# EAGLE design House LED board (EAGLE 9.5.0)
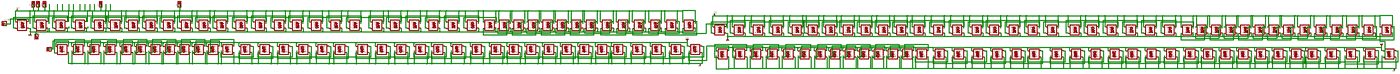
[diagram p0: schematic, sheet 1, overview]
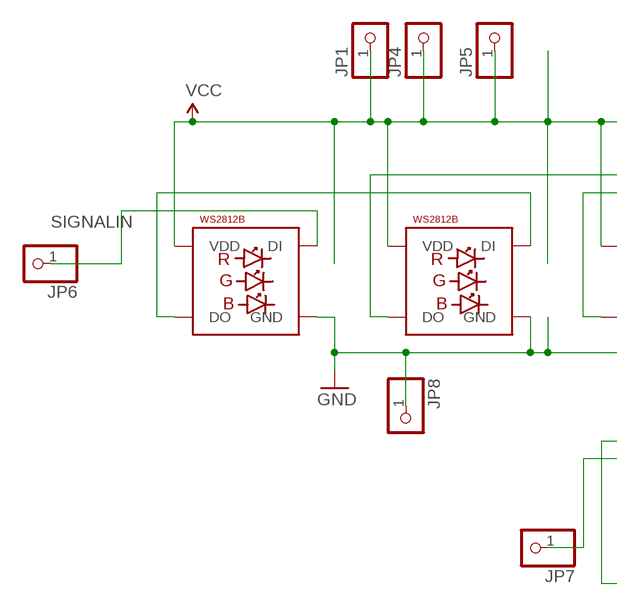
[diagram p1: schematic, sheet 1, part 1 of 8]
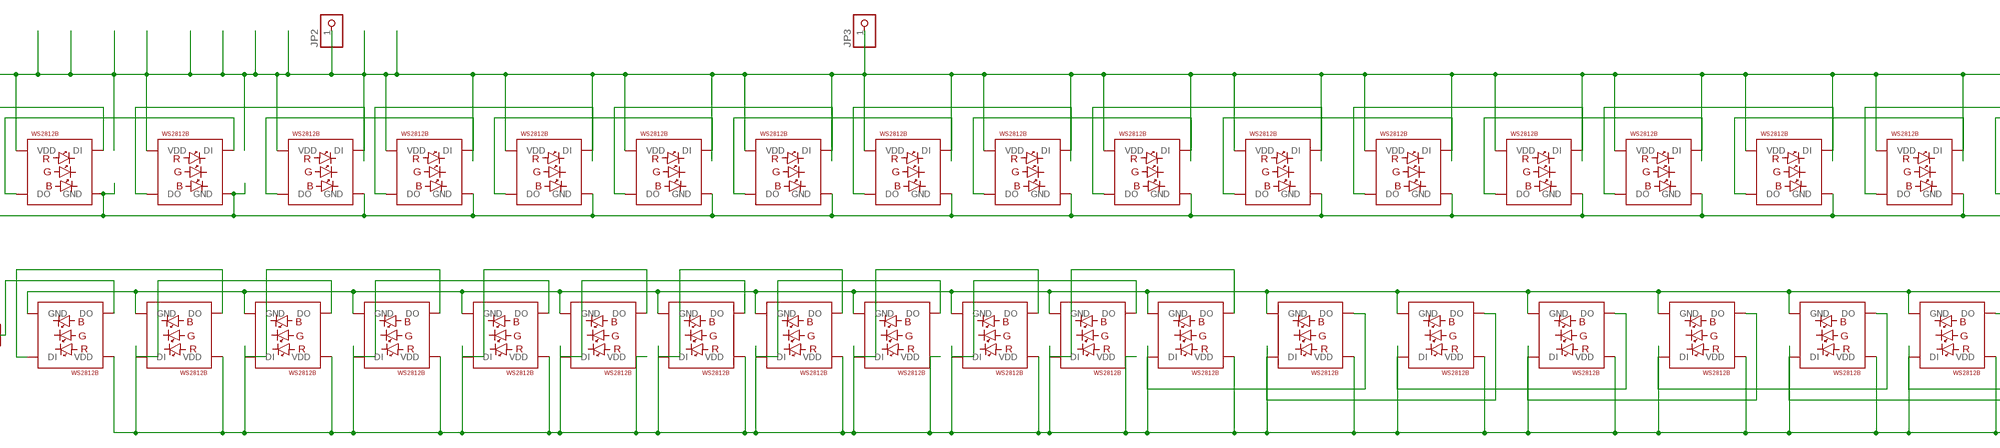
[diagram p2: schematic, sheet 1, part 2 of 8]
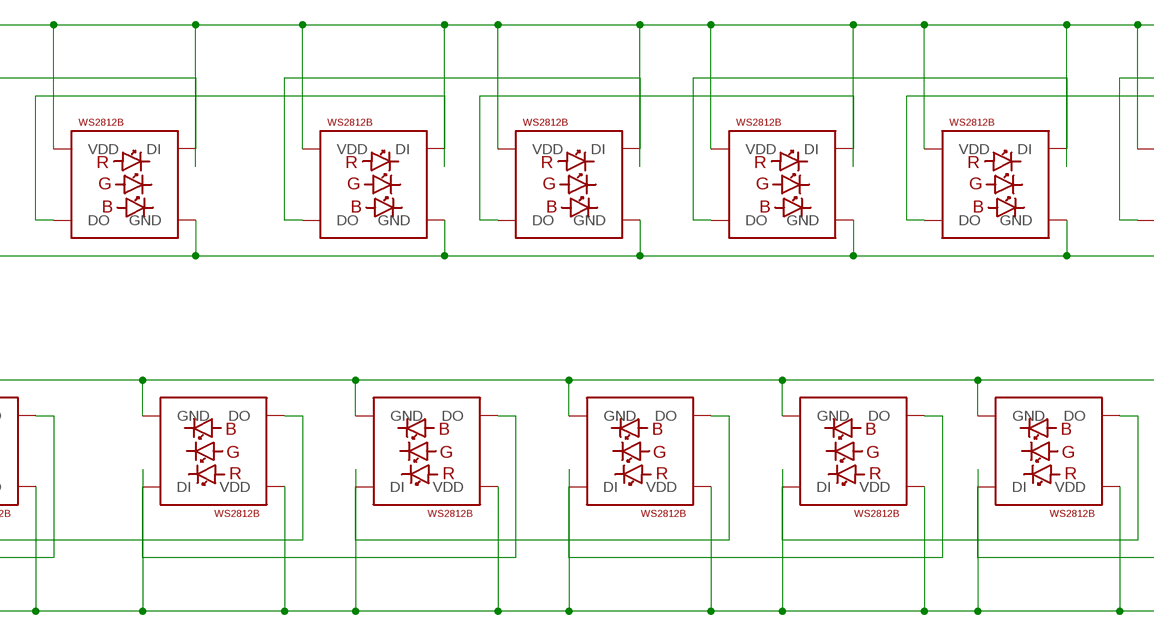
[diagram p3: schematic, sheet 1, part 3 of 8]
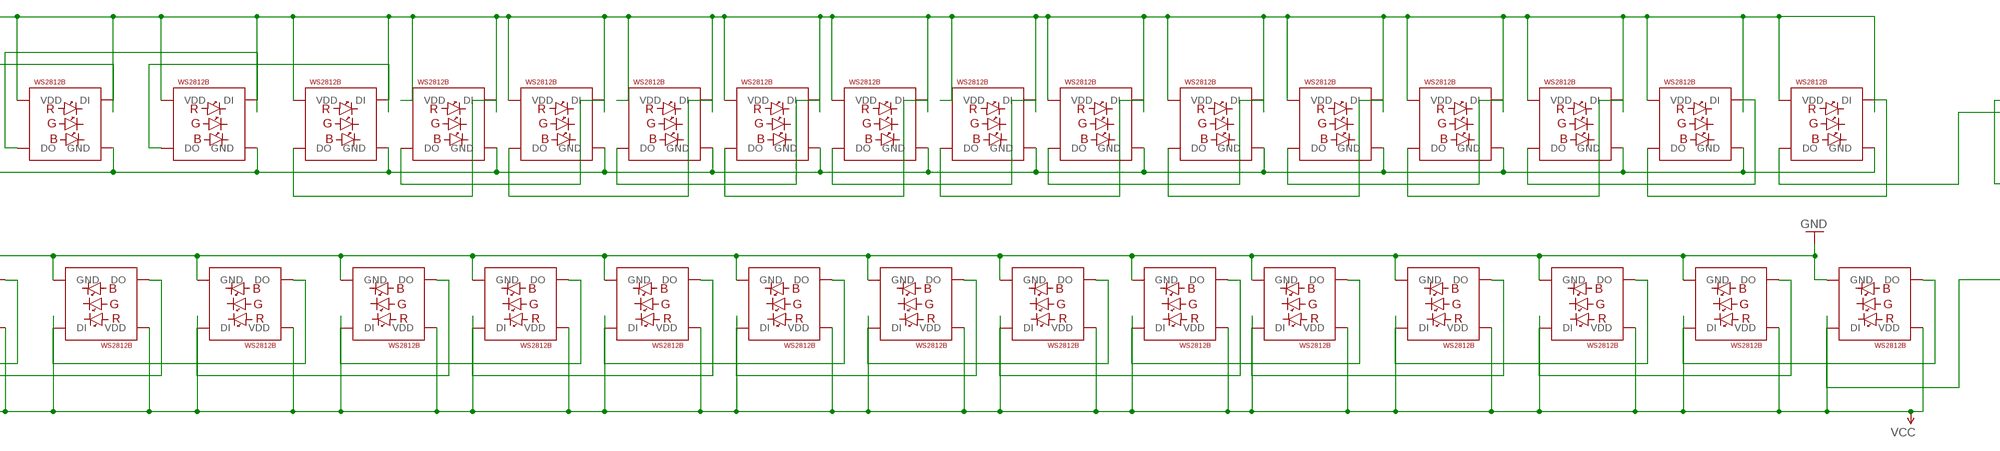
[diagram p4: schematic, sheet 1, part 4 of 8]
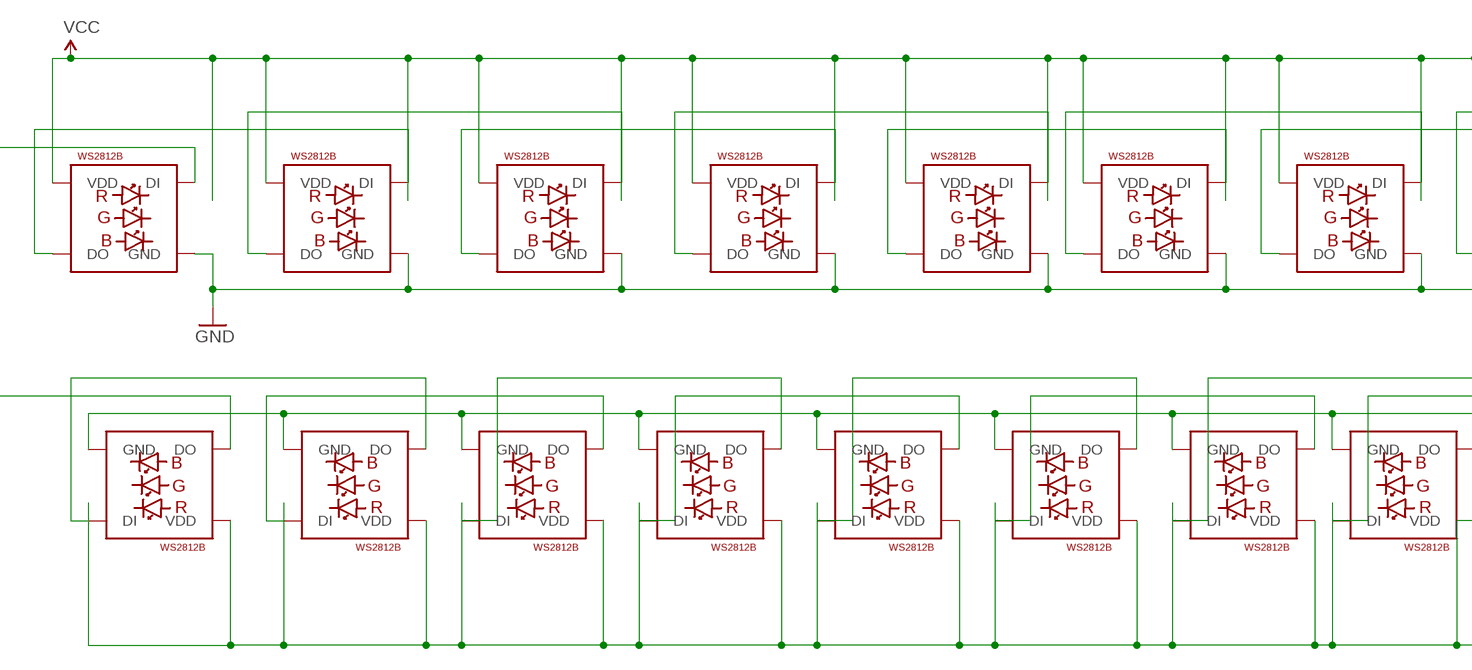
[diagram p5: schematic, sheet 1, part 5 of 8]
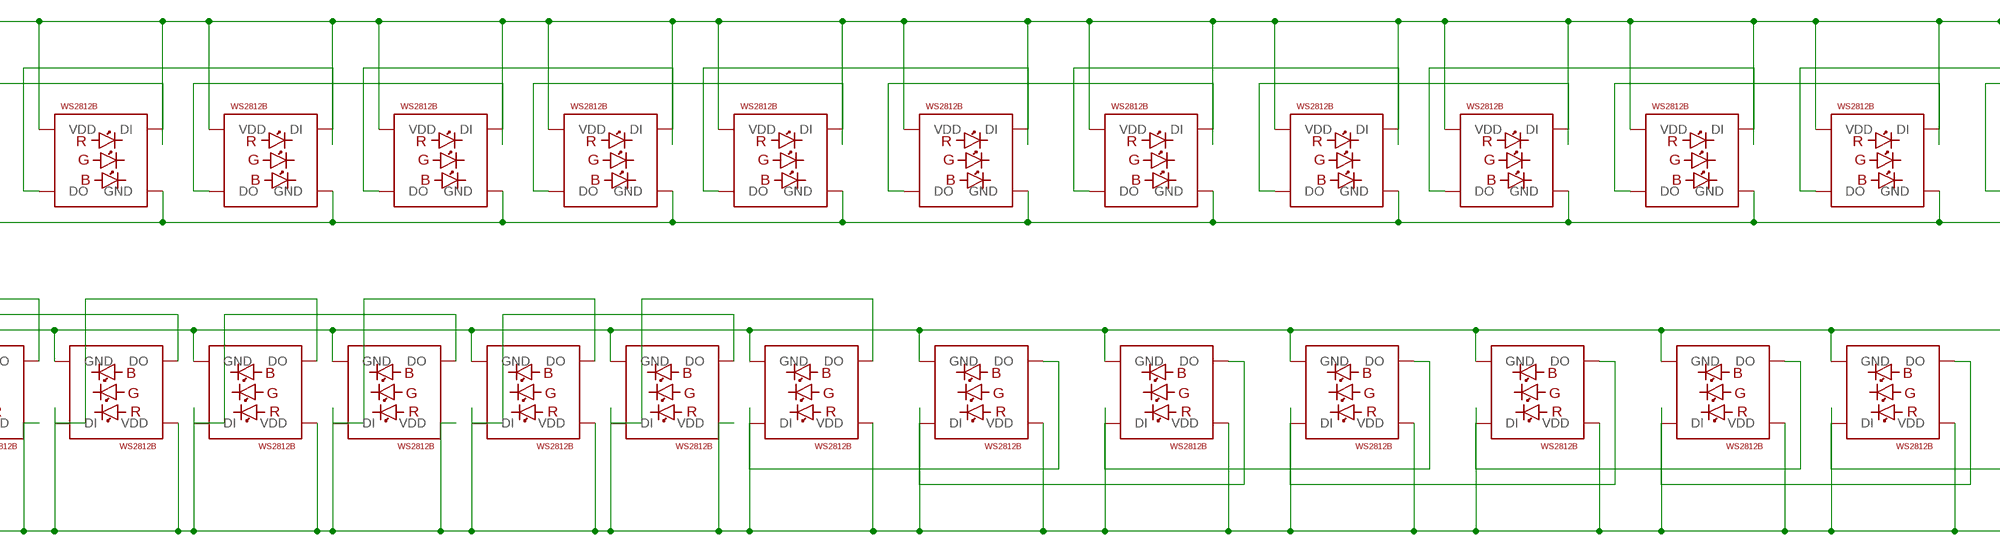
[diagram p6: schematic, sheet 1, part 6 of 8]
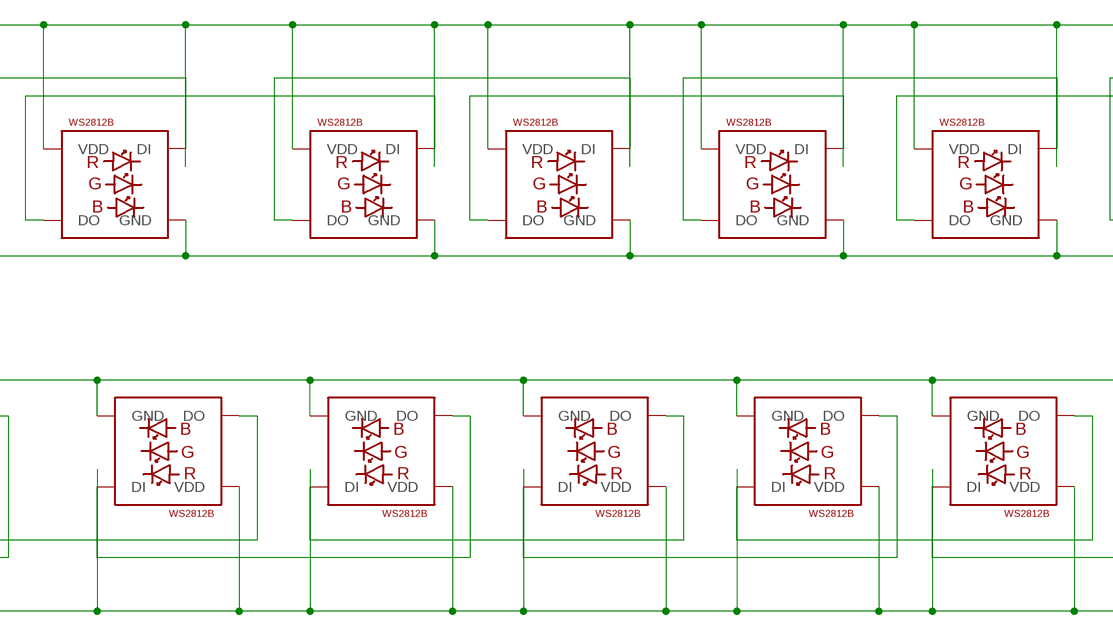
[diagram p7: schematic, sheet 1, part 7 of 8]
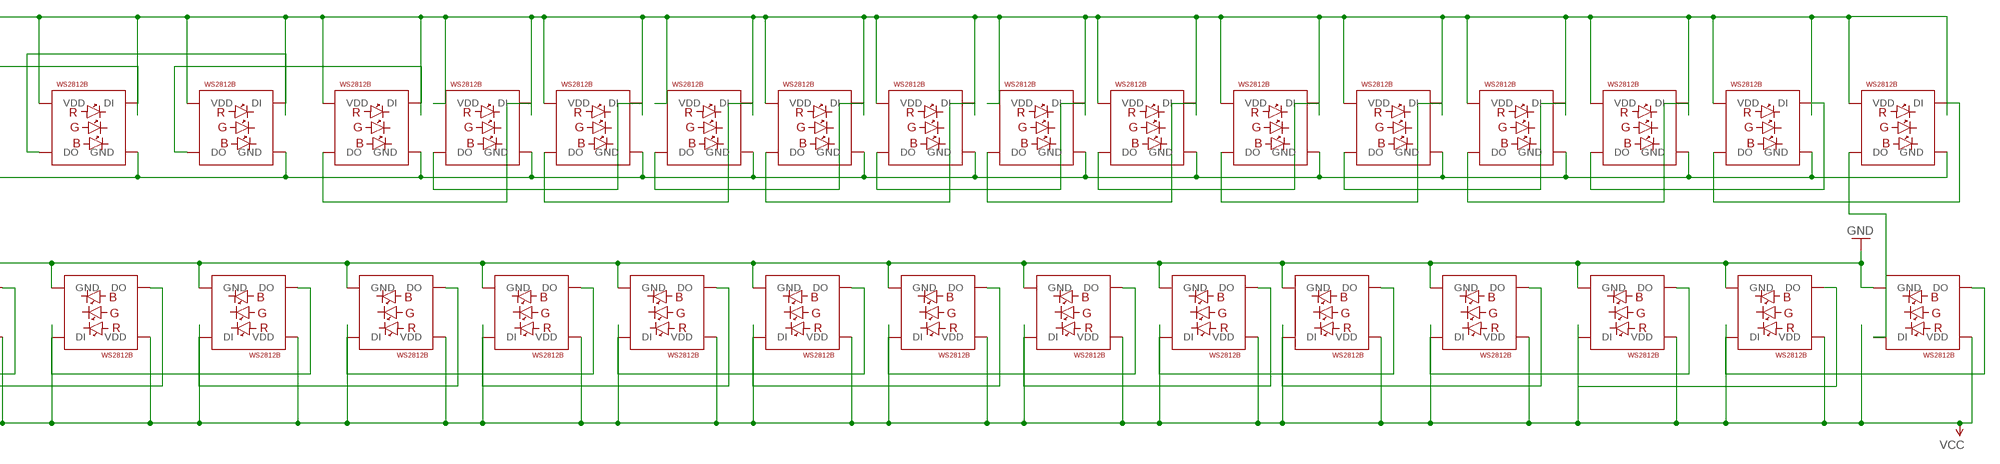
[diagram p8: schematic, sheet 1, part 8 of 8]

## Parts
JP1  PINHD-1X1  [1X01]
JP2  PINHD-1X1  [1X01]
JP3  PINHD-1X1  [1X01]
JP4  PINHD-1X1  [1X01]
JP5  PINHD-1X1  [1X01]
JP6  PINHD-1X1  [1X01]
JP7  PINHD-1X1  [1X01]
JP8  PINHD-1X1  [1X01]
LED1  WS2812B5050  [WS2812B]
LED2  WS2812B5050  [WS2812B]
LED3  WS2812B5050  [WS2812B]
LED4  WS2812B5050  [WS2812B]
LED5  WS2812B5050  [WS2812B]
LED6  WS2812B5050  [WS2812B]
LED7  WS2812B5050  [WS2812B]
LED8  WS2812B5050  [WS2812B]
LED9  WS2812B5050  [WS2812B]
LED10  WS2812B5050  [WS2812B]
LED11  WS2812B5050  [WS2812B]
LED12  WS2812B5050  [WS2812B]
LED13  WS2812B5050  [WS2812B]
LED14  WS2812B5050  [WS2812B]
LED15  WS2812B5050  [WS2812B]
LED16  WS2812B5050  [WS2812B]
LED17  WS2812B5050  [WS2812B]
LED18  WS2812B5050  [WS2812B]
LED19  WS2812B5050  [WS2812B]
LED20  WS2812B5050  [WS2812B]
LED21  WS2812B5050  [WS2812B]
LED22  WS2812B5050  [WS2812B]
LED23  WS2812B5050  [WS2812B]
LED24  WS2812B5050  [WS2812B]
LED25  WS2812B5050  [WS2812B]
LED26  WS2812B5050  [WS2812B]
LED27  WS2812B5050  [WS2812B]
LED28  WS2812B5050  [WS2812B]
LED29  WS2812B5050  [WS2812B]
LED30  WS2812B5050  [WS2812B]
LED31  WS2812B5050  [WS2812B]
LED32  WS2812B5050  [WS2812B]
LED33  WS2812B5050  [WS2812B]
LED34  WS2812B5050  [WS2812B]
LED35  WS2812B5050  [WS2812B]
LED36  WS2812B5050  [WS2812B]
LED37  WS2812B5050  [WS2812B]
LED38  WS2812B5050  [WS2812B]
LED39  WS2812B5050  [WS2812B]
LED40  WS2812B5050  [WS2812B]
LED41  WS2812B5050  [WS2812B]
LED42  WS2812B5050  [WS2812B]
LED43  WS2812B5050  [WS2812B]
LED44  WS2812B5050  [WS2812B]
LED45  WS2812B5050  [WS2812B]
LED46  WS2812B5050  [WS2812B]
LED47  WS2812B5050  [WS2812B]
LED48  WS2812B5050  [WS2812B]
LED49  WS2812B5050  [WS2812B]
LED50  WS2812B5050  [WS2812B]
LED51  WS2812B5050  [WS2812B]
LED52  WS2812B5050  [WS2812B]
LED53  WS2812B5050  [WS2812B]
LED54  WS2812B5050  [WS2812B]
LED55  WS2812B5050  [WS2812B]
LED56  WS2812B5050  [WS2812B]
LED57  WS2812B5050  [WS2812B]
LED58  WS2812B5050  [WS2812B]
LED59  WS2812B5050  [WS2812B]
LED60  WS2812B5050  [WS2812B]
LED61  WS2812B5050  [WS2812B]
LED62  WS2812B5050  [WS2812B]
LED63  WS2812B5050  [WS2812B]
LED64  WS2812B5050  [WS2812B]
LED65  WS2812B5050  [WS2812B]
LED66  WS2812B5050  [WS2812B]
LED67  WS2812B5050  [WS2812B]
LED68  WS2812B5050  [WS2812B]
LED69  WS2812B5050  [WS2812B]
LED70  WS2812B5050  [WS2812B]
LED71  WS2812B5050  [WS2812B]
LED72  WS2812B5050  [WS2812B]
LED73  WS2812B5050  [WS2812B]
LED74  WS2812B5050  [WS2812B]
LED75  WS2812B5050  [WS2812B]
LED76  WS2812B5050  [WS2812B]
LED77  WS2812B5050  [WS2812B]
LED78  WS2812B5050  [WS2812B]
LED79  WS2812B5050  [WS2812B]
LED80  WS2812B5050  [WS2812B]
LED81  WS2812B5050  [WS2812B]
LED82  WS2812B5050  [WS2812B]
LED83  WS2812B5050  [WS2812B]
LED84  WS2812B5050  [WS2812B]
LED85  WS2812B5050  [WS2812B]
LED86  WS2812B5050  [WS2812B]
LED87  WS2812B5050  [WS2812B]
LED88  WS2812B5050  [WS2812B]
LED89  WS2812B5050  [WS2812B]
LED90  WS2812B5050  [WS2812B]
LED91  WS2812B5050  [WS2812B]
LED92  WS2812B5050  [WS2812B]
LED93  WS2812B5050  [WS2812B]
LED94  WS2812B5050  [WS2812B]
LED95  WS2812B5050  [WS2812B]
LED96  WS2812B5050  [WS2812B]
LED97  WS2812B5050  [WS2812B]
LED98  WS2812B5050  [WS2812B]
LED99  WS2812B5050  [WS2812B]
LED100  WS2812B5050  [WS2812B]
LED101  WS2812B5050  [WS2812B]
LED102  WS2812B5050  [WS2812B]
LED103  WS2812B5050  [WS2812B]
LED104  WS2812B5050  [WS2812B]
LED105  WS2812B5050  [WS2812B]
LED106  WS2812B5050  [WS2812B]
LED107  WS2812B5050  [WS2812B]
LED108  WS2812B5050  [WS2812B]
LED109  WS2812B5050  [WS2812B]
LED110  WS2812B5050  [WS2812B]
LED111  WS2812B5050  [WS2812B]
LED112  WS2812B5050  [WS2812B]
LED113  WS2812B5050  [WS2812B]
LED114  WS2812B5050  [WS2812B]
LED115  WS2812B5050  [WS2812B]
LED116  WS2812B5050  [WS2812B]
LED117  WS2812B5050  [WS2812B]
LED118  WS2812B5050  [WS2812B]
LED119  WS2812B5050  [WS2812B]
LED120  WS2812B5050  [WS2812B]
LED121  WS2812B5050  [WS2812B]
LED122  WS2812B5050  [WS2812B]
LED123  WS2812B5050  [WS2812B]
LED124  WS2812B5050  [WS2812B]
LED125  WS2812B5050  [WS2812B]
LED126  WS2812B5050  [WS2812B]
LED127  WS2812B5050  [WS2812B]
LED128  WS2812B5050  [WS2812B]
LED129  WS2812B5050  [WS2812B]
LED130  WS2812B5050  [WS2812B]
LED131  WS2812B5050  [WS2812B]
LED132  WS2812B5050  [WS2812B]
LED133  WS2812B5050  [WS2812B]
LED134  WS2812B5050  [WS2812B]
LED135  WS2812B5050  [WS2812B]
LED136  WS2812B5050  [WS2812B]
LED137  WS2812B5050  [WS2812B]
LED138  WS2812B5050  [WS2812B]
LED139  WS2812B5050  [WS2812B]
LED140  WS2812B5050  [WS2812B]
LED141  WS2812B5050  [WS2812B]
LED142  WS2812B5050  [WS2812B]
LED143  WS2812B5050  [WS2812B]
LED144  WS2812B5050  [WS2812B]
LED145  WS2812B5050  [WS2812B]
LED146  WS2812B5050  [WS2812B]
LED147  WS2812B5050  [WS2812B]
LED148  WS2812B5050  [WS2812B]
LED149  WS2812B5050  [WS2812B]
LED150  WS2812B5050  [WS2812B]
LED151  WS2812B5050  [WS2812B]
LED152  WS2812B5050  [WS2812B]
LED153  WS2812B5050  [WS2812B]
LED154  WS2812B5050  [WS2812B]

## Nets
5V: JP1.1 JP2.1 JP3.1 JP4.1 JP5.1 LED1.1-VDD(VDD) LED2.1-VDD(VDD) LED3.1-VDD(VDD) LED4.1-VDD(VDD) LED5.1-VDD(VDD) LED6.1-VDD(VDD) LED7.1-VDD(VDD) LED8.1-VDD(VDD) LED9.1-VDD(VDD) LED10.1-VDD(VDD) LED11.1-VDD(VDD) LED12.1-VDD(VDD) LED13.1-VDD(VDD) LED14.1-VDD(VDD) LED15.1-VDD(VDD) LED16.1-VDD(VDD) LED17.1-VDD(VDD) LED18.1-VDD(VDD) LED19.1-VDD(VDD) LED20.1-VDD(VDD) LED21.1-VDD(VDD) LED22.1-VDD(VDD) LED23.1-VDD(VDD) LED24.1-VDD(VDD) LED25.1-VDD(VDD) LED26.1-VDD(VDD) LED27.1-VDD(VDD) LED28.1-VDD(VDD) LED29.1-VDD(VDD) LED30.1-VDD(VDD) LED31.1-VDD(VDD) LED32.1-VDD(VDD) LED33.1-VDD(VDD) LED34.1-VDD(VDD) LED35.1-VDD(VDD) LED36.1-VDD(VDD) LED37.1-VDD(VDD) LED38.1-VDD(VDD) LED39.1-VDD(VDD) LED40.1-VDD(VDD) LED41.1-VDD(VDD) LED42.1-VDD(VDD) LED43.1-VDD(VDD) LED44.1-VDD(VDD) LED45.1-VDD(VDD) LED46.1-VDD(VDD) LED47.1-VDD(VDD) LED48.1-VDD(VDD) LED49.1-VDD(VDD) LED50.1-VDD(VDD) LED51.1-VDD(VDD) LED52.1-VDD(VDD) LED53.1-VDD(VDD) LED54.1-VDD(VDD) LED55.1-VDD(VDD) LED56.1-VDD(VDD) LED57.1-VDD(VDD) LED58.1-VDD(VDD) LED59.1-VDD(VDD) LED60.1-VDD(VDD) LED61.1-VDD(VDD) LED62.1-VDD(VDD) LED63.1-VDD(VDD) LED64.1-VDD(VDD) LED65.1-VDD(VDD) LED66.1-VDD(VDD) LED67.1-VDD(VDD) LED68.1-VDD(VDD) LED69.1-VDD(VDD) LED70.1-VDD(VDD) LED71.1-VDD(VDD) LED72.1-VDD(VDD) LED73.1-VDD(VDD) LED74.1-VDD(VDD) LED75.1-VDD(VDD) LED76.1-VDD(VDD) LED77.1-VDD(VDD) LED78.1-VDD(VDD) LED79.1-VDD(VDD) LED80.1-VDD(VDD) LED81.1-VDD(VDD) LED82.1-VDD(VDD) LED83.1-VDD(VDD) LED84.1-VDD(VDD) LED85.1-VDD(VDD) LED86.1-VDD(VDD) LED87.1-VDD(VDD) LED88.1-VDD(VDD) LED89.1-VDD(VDD) LED90.1-VDD(VDD) LED91.1-VDD(VDD) LED92.1-VDD(VDD) LED93.1-VDD(VDD) LED94.1-VDD(VDD) LED95.1-VDD(VDD) LED96.1-VDD(VDD) LED97.1-VDD(VDD) LED98.1-VDD(VDD) LED99.1-VDD(VDD) LED100.1-VDD(VDD) LED101.1-VDD(VDD) LED102.1-VDD(VDD) LED103.1-VDD(VDD) LED104.1-VDD(VDD) LED105.1-VDD(VDD) LED106.1-VDD(VDD) LED107.1-VDD(VDD) LED108.1-VDD(VDD) LED109.1-VDD(VDD) LED110.1-VDD(VDD) LED111.1-VDD(VDD) LED112.1-VDD(VDD) LED113.1-VDD(VDD) LED114.1-VDD(VDD) LED115.1-VDD(VDD) LED116.1-VDD(VDD) LED117.1-VDD(VDD) LED118.1-VDD(VDD) LED119.1-VDD(VDD) LED120.1-VDD(VDD) LED121.1-VDD(VDD) LED122.1-VDD(VDD) LED123.1-VDD(VDD) LED124.1-VDD(VDD) LED125.1-VDD(VDD) LED126.1-VDD(VDD) LED127.1-VDD(VDD) LED128.1-VDD(VDD) LED129.1-VDD(VDD) LED130.1-VDD(VDD) LED131.1-VDD(VDD) LED132.1-VDD(VDD) LED133.1-VDD(VDD) LED134.1-VDD(VDD) LED135.1-VDD(VDD) LED136.1-VDD(VDD) LED137.1-VDD(VDD) LED138.1-VDD(VDD) LED139.1-VDD(VDD) LED140.1-VDD(VDD) LED141.1-VDD(VDD) LED142.1-VDD(VDD) LED143.1-VDD(VDD) LED144.1-VDD(VDD) LED145.1-VDD(VDD) LED146.1-VDD(VDD) LED147.1-VDD(VDD) LED148.1-VDD(VDD) LED149.1-VDD(VDD) LED150.1-VDD(VDD) LED151.1-VDD(VDD) LED152.1-VDD(VDD) LED153.1-VDD(VDD) LED154.1-VDD(VDD) ; supply symbol labelled VCC
GND: JP8.1 LED1.3-GND(GND) LED2.3-GND(GND) LED3.3-GND(GND) LED4.3-GND(GND) LED5.3-GND(GND) LED6.3-GND(GND) LED7.3-GND(GND) LED8.3-GND(GND) LED9.3-GND(GND) LED10.3-GND(GND) LED11.3-GND(GND) LED12.3-GND(GND) LED13.3-GND(GND) LED14.3-GND(GND) LED15.3-GND(GND) LED16.3-GND(GND) LED17.3-GND(GND) LED18.3-GND(GND) LED19.3-GND(GND) LED20.3-GND(GND) LED21.3-GND(GND) LED22.3-GND(GND) LED23.3-GND(GND) LED24.3-GND(GND) LED25.3-GND(GND) LED26.3-GND(GND) LED27.3-GND(GND) LED28.3-GND(GND) LED29.3-GND(GND) LED30.3-GND(GND) LED31.3-GND(GND) LED32.3-GND(GND) LED33.3-GND(GND) LED34.3-GND(GND) LED35.3-GND(GND) LED36.3-GND(GND) LED37.3-GND(GND) LED38.3-GND(GND) LED39.3-GND(GND) LED40.3-GND(GND) LED41.3-GND(GND) LED42.3-GND(GND) LED43.3-GND(GND) LED44.3-GND(GND) LED45.3-GND(GND) LED46.3-GND(GND) LED47.3-GND(GND) LED48.3-GND(GND) LED49.3-GND(GND) LED50.3-GND(GND) LED51.3-GND(GND) LED52.3-GND(GND) LED53.3-GND(GND) LED54.3-GND(GND) LED55.3-GND(GND) LED56.3-GND(GND) LED57.3-GND(GND) LED58.3-GND(GND) LED59.3-GND(GND) LED60.3-GND(GND) LED61.3-GND(GND) LED62.3-GND(GND) LED63.3-GND(GND) LED64.3-GND(GND) LED65.3-GND(GND) LED66.3-GND(GND) LED67.3-GND(GND) LED68.3-GND(GND) LED69.3-GND(GND) LED70.3-GND(GND) LED71.3-GND(GND) LED72.3-GND(GND) LED73.3-GND(GND) LED74.3-GND(GND) LED75.3-GND(GND) LED76.3-GND(GND) LED77.3-GND(GND) LED78.3-GND(GND) LED79.3-GND(GND) LED80.3-GND(GND) LED81.3-GND(GND) LED82.3-GND(GND) LED83.3-GND(GND) LED84.3-GND(GND) LED85.3-GND(GND) LED86.3-GND(GND) LED87.3-GND(GND) LED88.3-GND(GND) LED89.3-GND(GND) LED90.3-GND(GND) LED91.3-GND(GND) LED92.3-GND(GND) LED93.3-GND(GND) LED94.3-GND(GND) LED95.3-GND(GND) LED96.3-GND(GND) LED97.3-GND(GND) LED98.3-GND(GND) LED99.3-GND(GND) LED100.3-GND(GND) LED101.3-GND(GND) LED102.3-GND(GND) LED103.3-GND(GND) LED104.3-GND(GND) LED105.3-GND(GND) LED106.3-GND(GND) LED107.3-GND(GND) LED108.3-GND(GND) LED109.3-GND(GND) LED110.3-GND(GND) LED111.3-GND(GND) LED112.3-GND(GND) LED113.3-GND(GND) LED114.3-GND(GND) LED115.3-GND(GND) LED116.3-GND(GND) LED117.3-GND(GND) LED118.3-GND(GND) LED119.3-GND(GND) LED120.3-GND(GND) LED121.3-GND(GND) LED122.3-GND(GND) LED123.3-GND(GND) LED124.3-GND(GND) LED125.3-GND(GND) LED126.3-GND(GND) LED127.3-GND(GND) LED128.3-GND(GND) LED129.3-GND(GND) LED130.3-GND(GND) LED131.3-GND(GND) LED132.3-GND(GND) LED133.3-GND(GND) LED134.3-GND(GND) LED135.3-GND(GND) LED136.3-GND(GND) LED137.3-GND(GND) LED138.3-GND(GND) LED139.3-GND(GND) LED140.3-GND(GND) LED141.3-GND(GND) LED142.3-GND(GND) LED143.3-GND(GND) LED144.3-GND(GND) LED145.3-GND(GND) LED146.3-GND(GND) LED147.3-GND(GND) LED148.3-GND(GND) LED149.3-GND(GND) LED150.3-GND(GND) LED151.3-GND(GND) LED152.3-GND(GND) LED153.3-GND(GND) LED154.3-GND(GND)
N$1: LED5.2-DOUT(DO) LED6.4-DIN(DI)
N$2: LED1.2-DOUT(DO) LED2.4-DIN(DI)
N$3: LED2.2-DOUT(DO) LED3.4-DIN(DI)
N$4: LED3.2-DOUT(DO) LED4.4-DIN(DI)
N$5: LED4.2-DOUT(DO) LED5.4-DIN(DI)
N$6: LED6.2-DOUT(DO) LED7.4-DIN(DI)
N$7: LED7.2-DOUT(DO) LED8.4-DIN(DI)
N$8: LED8.2-DOUT(DO) LED9.4-DIN(DI)
N$9: LED9.2-DOUT(DO) LED10.4-DIN(DI)
N$10: LED10.2-DOUT(DO) LED11.4-DIN(DI)
N$11: LED11.2-DOUT(DO) LED12.4-DIN(DI)
N$12: LED12.2-DOUT(DO) LED13.4-DIN(DI)
N$13: LED13.2-DOUT(DO) LED14.4-DIN(DI)
N$14: LED14.2-DOUT(DO) LED15.4-DIN(DI)
N$15: LED15.2-DOUT(DO) LED16.4-DIN(DI)
N$16: LED16.2-DOUT(DO) LED17.4-DIN(DI)
N$17: LED17.2-DOUT(DO) LED18.4-DIN(DI)
N$18: LED18.2-DOUT(DO) LED19.4-DIN(DI)
N$19: LED19.2-DOUT(DO) LED20.4-DIN(DI)
N$20: LED20.2-DOUT(DO) LED21.4-DIN(DI)
N$21: LED21.2-DOUT(DO) LED22.4-DIN(DI)
N$22: LED22.2-DOUT(DO) LED23.4-DIN(DI)
N$23: LED23.2-DOUT(DO) LED24.4-DIN(DI)
N$24: LED24.2-DOUT(DO) LED25.4-DIN(DI)
N$25: LED25.2-DOUT(DO) LED26.4-DIN(DI)
N$26: LED26.2-DOUT(DO) LED27.4-DIN(DI)
N$27: LED27.2-DOUT(DO) LED28.4-DIN(DI)
N$28: LED28.2-DOUT(DO) LED29.4-DIN(DI)
N$29: LED29.2-DOUT(DO) LED30.4-DIN(DI)
N$30: LED30.2-DOUT(DO) LED31.4-DIN(DI)
N$31: LED31.2-DOUT(DO) LED32.4-DIN(DI)
N$32: LED32.2-DOUT(DO) LED33.4-DIN(DI)
N$33: LED33.2-DOUT(DO) LED34.4-DIN(DI)
N$34: LED34.2-DOUT(DO) LED35.4-DIN(DI)
N$35: LED35.2-DOUT(DO) LED36.4-DIN(DI)
N$36: LED36.2-DOUT(DO) LED37.4-DIN(DI)
N$37: LED37.2-DOUT(DO) LED38.4-DIN(DI)
N$38: LED38.2-DOUT(DO) LED39.4-DIN(DI)
N$39: LED40.2-DOUT(DO) LED41.4-DIN(DI)
N$40: LED42.2-DOUT(DO) LED43.4-DIN(DI)
N$41: LED43.2-DOUT(DO) LED44.4-DIN(DI)
N$42: LED44.2-DOUT(DO) LED45.4-DIN(DI)
N$43: LED45.2-DOUT(DO) LED46.4-DIN(DI)
N$44: LED46.2-DOUT(DO) LED47.4-DIN(DI)
N$45: LED47.2-DOUT(DO) LED48.4-DIN(DI)
N$46: LED48.2-DOUT(DO) LED49.4-DIN(DI)
N$47: LED49.2-DOUT(DO) LED50.4-DIN(DI)
N$48: LED50.2-DOUT(DO) LED51.4-DIN(DI)
N$49: LED51.2-DOUT(DO) LED52.4-DIN(DI)
N$50: LED52.2-DOUT(DO) LED53.4-DIN(DI)
N$51: LED53.2-DOUT(DO) LED54.4-DIN(DI)
N$52: LED54.2-DOUT(DO) LED55.4-DIN(DI)
N$53: LED55.2-DOUT(DO) LED56.4-DIN(DI)
N$54: LED56.2-DOUT(DO) LED57.4-DIN(DI)
N$55: LED57.2-DOUT(DO) LED58.4-DIN(DI)
N$56: LED58.2-DOUT(DO) LED59.4-DIN(DI)
N$57: LED59.2-DOUT(DO) LED60.4-DIN(DI)
N$58: LED60.2-DOUT(DO) LED61.4-DIN(DI)
N$59: LED61.2-DOUT(DO) LED62.4-DIN(DI)
N$60: LED62.2-DOUT(DO) LED63.4-DIN(DI)
N$61: LED63.2-DOUT(DO) LED64.4-DIN(DI)
N$62: LED64.2-DOUT(DO) LED65.4-DIN(DI)
N$63: LED41.2-DOUT(DO) LED42.4-DIN(DI)
N$64: LED65.2-DOUT(DO) LED66.4-DIN(DI)
N$65: LED66.2-DOUT(DO) LED67.4-DIN(DI)
N$66: LED67.2-DOUT(DO) LED68.4-DIN(DI)
N$67: LED68.2-DOUT(DO) LED69.4-DIN(DI)
N$68: LED69.2-DOUT(DO) LED70.4-DIN(DI)
N$69: LED70.2-DOUT(DO) LED71.4-DIN(DI)
N$70: LED71.2-DOUT(DO) LED72.4-DIN(DI)
N$71: LED72.2-DOUT(DO) LED73.4-DIN(DI)
N$72: LED73.2-DOUT(DO) LED74.4-DIN(DI)
N$73: LED74.2-DOUT(DO) LED75.4-DIN(DI)
N$74: LED75.2-DOUT(DO) LED76.4-DIN(DI)
N$75: LED76.2-DOUT(DO) LED77.4-DIN(DI)
N$76: LED77.2-DOUT(DO) LED78.4-DIN(DI)
N$77: LED39.2-DOUT(DO) LED40.4-DIN(DI)
N$78: LED79.2-DOUT(DO) LED80.4-DIN(DI)
N$79: LED81.2-DOUT(DO) LED82.4-DIN(DI)
N$80: LED82.2-DOUT(DO) LED83.4-DIN(DI)
N$81: LED83.2-DOUT(DO) LED84.4-DIN(DI)
N$82: LED84.2-DOUT(DO) LED85.4-DIN(DI)
N$83: LED85.2-DOUT(DO) LED86.4-DIN(DI)
N$84: LED86.2-DOUT(DO) LED87.4-DIN(DI)
N$85: LED87.2-DOUT(DO) LED88.4-DIN(DI)
N$86: LED88.2-DOUT(DO) LED89.4-DIN(DI)
N$87: LED89.2-DOUT(DO) LED90.4-DIN(DI)
N$88: LED90.2-DOUT(DO) LED91.4-DIN(DI)
N$89: LED91.2-DOUT(DO) LED92.4-DIN(DI)
N$90: LED92.2-DOUT(DO) LED93.4-DIN(DI)
N$91: LED93.2-DOUT(DO) LED94.4-DIN(DI)
N$92: LED94.2-DOUT(DO) LED95.4-DIN(DI)
N$93: LED95.2-DOUT(DO) LED96.4-DIN(DI)
N$94: LED96.2-DOUT(DO) LED97.4-DIN(DI)
N$95: LED97.2-DOUT(DO) LED98.4-DIN(DI)
N$96: LED98.2-DOUT(DO) LED99.4-DIN(DI)
N$97: LED99.2-DOUT(DO) LED100.4-DIN(DI)
N$98: LED100.2-DOUT(DO) LED101.4-DIN(DI)
N$99: LED101.2-DOUT(DO) LED102.4-DIN(DI)
N$100: LED102.2-DOUT(DO) LED103.4-DIN(DI)
N$101: LED103.2-DOUT(DO) LED104.4-DIN(DI)
N$102: LED80.2-DOUT(DO) LED81.4-DIN(DI)
N$103: LED104.2-DOUT(DO) LED105.4-DIN(DI)
N$104: LED105.2-DOUT(DO) LED106.4-DIN(DI)
N$105: LED106.2-DOUT(DO) LED107.4-DIN(DI)
N$106: LED107.2-DOUT(DO) LED108.4-DIN(DI)
N$107: LED108.2-DOUT(DO) LED109.4-DIN(DI)
N$108: LED109.2-DOUT(DO) LED110.4-DIN(DI)
N$109: LED110.2-DOUT(DO) LED111.4-DIN(DI)
N$110: LED111.2-DOUT(DO) LED112.4-DIN(DI)
N$111: LED112.2-DOUT(DO) LED113.4-DIN(DI)
N$112: LED113.2-DOUT(DO) LED114.4-DIN(DI)
N$113: LED114.2-DOUT(DO) LED115.4-DIN(DI)
N$114: LED115.2-DOUT(DO) LED116.4-DIN(DI)
N$115: LED116.2-DOUT(DO) LED117.4-DIN(DI)
N$116: LED78.2-DOUT(DO) LED79.4-DIN(DI)
N$117: LED118.2-DOUT(DO) LED119.4-DIN(DI)
N$118: LED120.2-DOUT(DO) LED121.4-DIN(DI)
N$119: LED121.2-DOUT(DO) LED122.4-DIN(DI)
N$120: LED122.2-DOUT(DO) LED123.4-DIN(DI)
N$121: LED123.2-DOUT(DO) LED124.4-DIN(DI)
N$122: LED124.2-DOUT(DO) LED125.4-DIN(DI)
N$123: LED125.2-DOUT(DO) LED126.4-DIN(DI)
N$124: LED126.2-DOUT(DO) LED127.4-DIN(DI)
N$125: LED127.2-DOUT(DO) LED128.4-DIN(DI)
N$126: LED128.2-DOUT(DO) LED129.4-DIN(DI)
N$127: LED129.2-DOUT(DO) LED130.4-DIN(DI)
N$128: LED130.2-DOUT(DO) LED131.4-DIN(DI)
N$129: LED131.2-DOUT(DO) LED132.4-DIN(DI)
N$130: LED132.2-DOUT(DO) LED133.4-DIN(DI)
N$131: LED133.2-DOUT(DO) LED134.4-DIN(DI)
N$132: LED134.2-DOUT(DO) LED135.4-DIN(DI)
N$133: LED135.2-DOUT(DO) LED136.4-DIN(DI)
N$134: LED136.2-DOUT(DO) LED137.4-DIN(DI)
N$135: LED137.2-DOUT(DO) LED138.4-DIN(DI)
N$136: LED138.2-DOUT(DO) LED139.4-DIN(DI)
N$137: LED139.2-DOUT(DO) LED140.4-DIN(DI)
N$138: LED140.2-DOUT(DO) LED141.4-DIN(DI)
N$139: LED141.2-DOUT(DO) LED142.4-DIN(DI)
N$140: LED142.2-DOUT(DO) LED143.4-DIN(DI)
N$141: LED119.2-DOUT(DO) LED120.4-DIN(DI)
N$142: LED143.2-DOUT(DO) LED144.4-DIN(DI)
N$143: LED144.2-DOUT(DO) LED145.4-DIN(DI)
N$144: LED145.2-DOUT(DO) LED146.4-DIN(DI)
N$145: LED146.2-DOUT(DO) LED147.4-DIN(DI)
N$146: LED147.2-DOUT(DO) LED148.4-DIN(DI)
N$147: LED148.2-DOUT(DO) LED149.4-DIN(DI)
N$148: LED149.2-DOUT(DO) LED150.4-DIN(DI)
N$149: LED150.2-DOUT(DO) LED151.4-DIN(DI)
N$150: LED151.2-DOUT(DO) LED152.4-DIN(DI)
N$151: LED152.2-DOUT(DO) LED153.4-DIN(DI)
N$152: LED153.2-DOUT(DO) LED154.4-DIN(DI)
N$155: LED117.2-DOUT(DO) LED118.4-DIN(DI)
N$159: JP7.1 LED154.2-DOUT(DO)
SIGNALIN: JP6.1 LED1.4-DIN(DI)

## Library data of the parts
JP1-JP8 = adafruit:PINHD-1X1: Pin header 1x1 for 0.1" spacing With round pins
LED1-LED154 = freetronics-jon:WS2812B

## Board
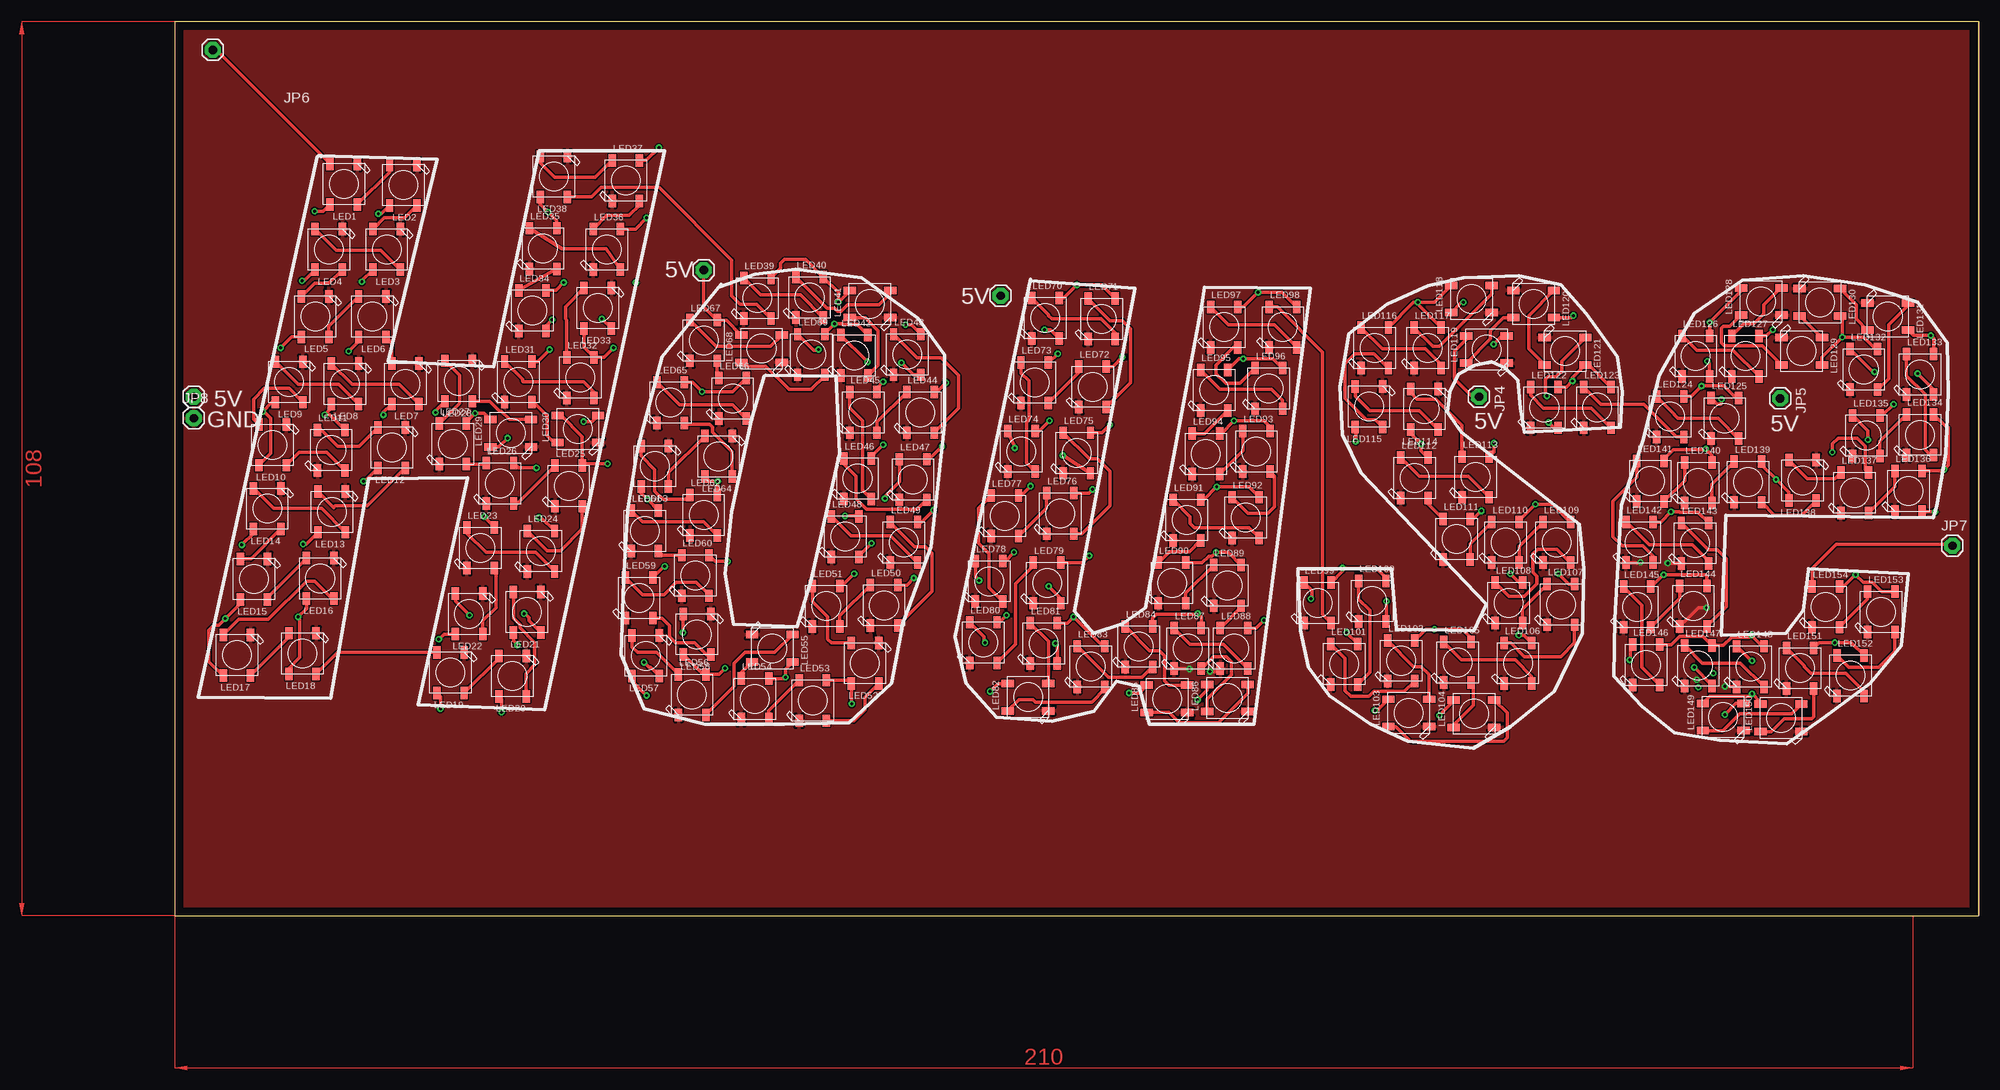
[diagram p9: board, top side]
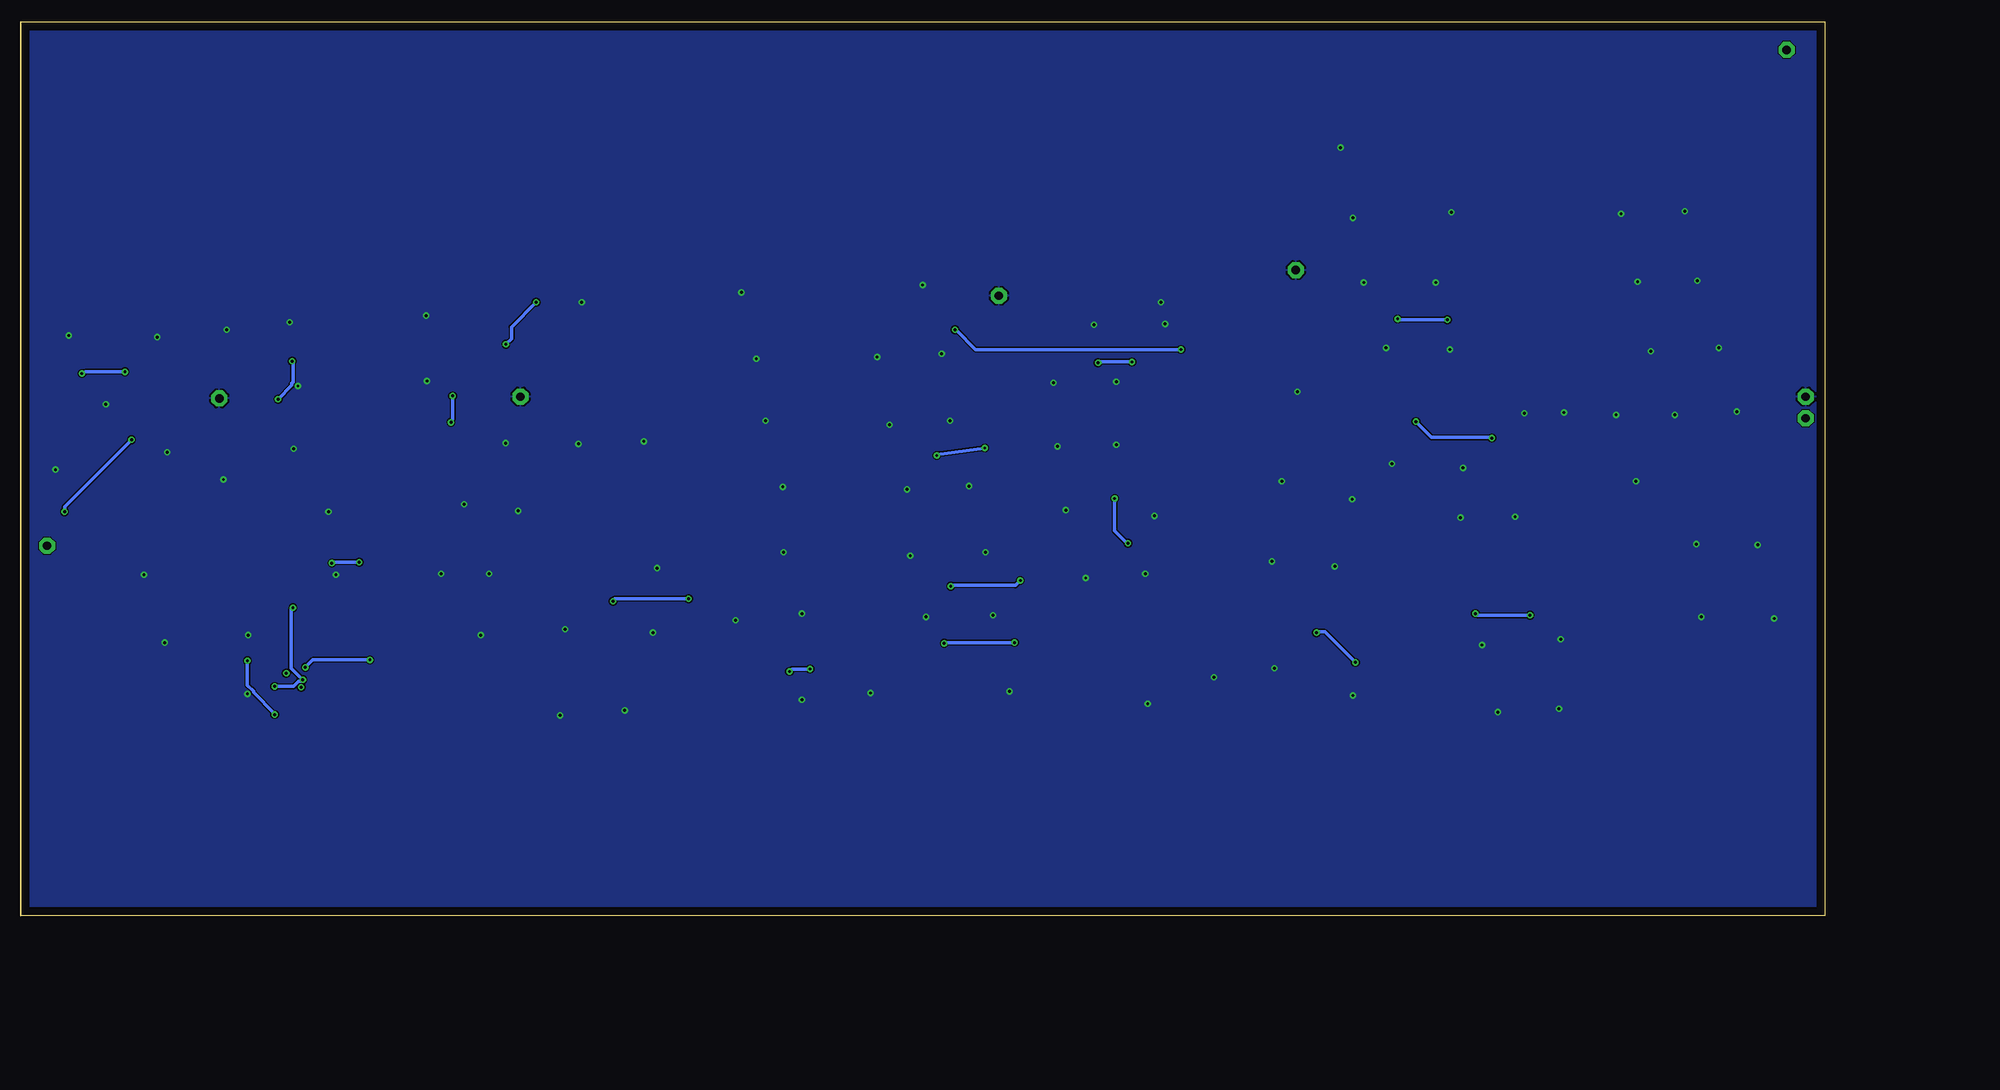
[diagram p10: board, bottom side, seen from below]

Size 218 x 108 mm. Coordinates in mm from the lower left corner, seen from the top.
Outline: 0,0 218,0 218,108 0,108 0,0
Copper layers (1*16): Top 0.035mm / dielectric 1.5mm / Bottom 0.035mm
Design rules "default": minimum track width 6mil, minimum drill 0.35mm, track to track 6mil, track to pad 6mil, pad to pad 6mil, via to via 6mil, smd to smd 6mil, copper to edge 40mil, drill to drill 6mil, minimum pad ring 10mil, minimum via ring 8mil, stop-mask expansion 4mil, vias tented up to drill 0mil, thermal gap 10mil

### Footprints (pad centres in the part's own frame; a part is rotated, then mirrored left to right if it is on the bottom)
1X01 = drill 1.016 pad 1.93 octagon: 1 0,0
WS2812B = smd 1.5 x 0.9: 1-VDD 2.45,-1.65; 2-DOUT 2.45,1.65; 3-GND -2.45,1.65; 4-DIN -2.45,-1.65

### Placement (x,y rotation side)
JP1  2.3,62.7 270 top
JP2  63.9,78 270 top
JP3  99.8,74.9 270 top
JP4  157.6,62.7 270 top
JP5  194,62.5 270 top
JP6  4.6,104.6 0 top
JP7  214.8,44.7 0 top
JP8  2.3,60.1 0 top
LED1  20.41,88.38 270 top
LED2  27.61,88.27 270 top
LED3  25.6,80.5 270 top
LED4  18.6,80.5 270 top
LED5  16.96,72.38 270 top
LED6  23.86,72.37 270 top
LED7  27.86,64.26 270 top
LED8  20.56,64.25 270 top
LED9  13.81,64.48 270 top
LED10  11.81,56.87 270 top
LED11  18.89,56.24 90 top
LED12  26.21,56.55 270 top
LED13  18.96,48.78 270 top
LED14  11.16,49.17 270 top
LED15  9.56,40.66 270 top
LED16  17.56,40.75 270 top
LED17  7.51,31.48 270 top
LED18  15.41,31.67 270 top
LED19  33.31,29.36 270 top
LED20  40.81,28.95 270 top
LED21  42.56,36.68 270 top
LED22  35.56,36.47 270 top
LED23  36.94,44.44 90 top
LED24  44.24,44.05 90 top
LED25  47.59,51.92 90 top
LED26  39.29,52.23 90 top
LED27  33.6,57 90 top
LED28  34.3,64.6 270 top
LED29  40.6,58.3 180 top
LED30  48.7,58.8 180 top
LED31  41.5,64.5 90 top
LED32  49,65 90 top
LED33  51.1,73.4 270 top
LED34  43.2,73.1 90 top
LED35  44.5,80.6 90 top
LED36  52.2,80.5 90 top
LED37  54.5,88.8 90 top
LED38  45.8,89.3 270 top
LED39  70.4,74.6 90 top
LED40  76.7,74.7 90 top
LED41  84,73.9 180 top
LED42  82.1,67.7 90 top
LED43  88.5,67.8 90 top
LED44  90.1,60.8 90 top
LED45  83.2,60.8 90 top
LED46  82.5,52.8 90 top
LED47  89.2,52.7 90 top
LED48  81,45.8 90 top
LED49  88.1,45.1 90 top
LED50  85.7,37.5 90 top
LED51  78.7,37.4 90 top
LED52  83.4,30.5 270 top
LED53  77.1,26 90 top
LED54  70.1,26.2 90 top
LED55  72.2,32.3 0 top
LED56  62.5,26.7 90 top
LED57  56.9,31.4 270 top
LED58  63.1,34 270 top
LED59  56.1,38.4 90 top
LED60  62.9,41.1 90 top
LED61  56.8,46.5 90 top
LED62  63.9,48.4 90 top
LED63  58,54.3 270 top
LED64  65.7,55.5 270 top
LED65  59.9,62 90 top
LED66  67.4,62.5 90 top
LED67  63.9,69.5 90 top
LED68  70.9,68.5 180 top
LED69  76.9,67.8 90 top
LED70  105.2,72.2 90 top
LED71  112,72.1 90 top
LED72  110.9,63.9 90 top
LED73  103.9,64.4 90 top
LED74  102.3,56.1 90 top
LED75  109,55.9 90 top
LED76  107,48.6 90 top
LED77  100.3,48.3 90 top
LED78  98.4,40.4 90 top
LED79  105.4,40.2 90 top
LED80  97.7,33 90 top
LED81  105,32.9 90 top
LED82  103.1,26.4 180 top
LED83  110.7,30.1 90 top
LED84  116.5,32.5 90 top
LED85  119.9,26.2 180 top
LED86  127.2,26.3 180 top
LED87  122.4,32.3 90 top
LED88  128,32.3 90 top
LED89  127.2,39.9 90 top
LED90  120.5,40.2 90 top
LED91  122.3,47.8 90 top
LED92  129.4,48.1 90 top
LED93  130.7,56.1 90 top
LED94  124.6,55.8 90 top
LED95  125.6,63.5 90 top
LED96  132.2,63.7 90 top
LED97  126.8,71.1 90 top
LED98  133.9,71.1 90 top
LED99  138.1,37.8 90 top
LED100  144.7,38 90 top
LED101  141.3,30.4 90 top
LED102  148.2,30.8 90 top
LED103  149.1,24.5 180 top
LED104  157,24.4 180 top
LED105  155,30.6 90 top
LED106  162.3,30.5 90 top
LED107  167.5,37.6 90 top
LED108  161.2,37.8 90 top
LED109  167,45.1 90 top
LED110  160.8,45.1 90 top
LED111  154.9,45.5 90 top
LED112  149.8,52.9 90 top
LED113  157.2,53 90 top
LED114  151,61.2 270 top
LED115  144.3,61.5 270 top
LED116  145,68.6 90 top
LED117  151.4,68.6 90 top
LED118  156.7,74.5 180 top
LED119  158.5,68.4 180 top
LED120  164.2,73.9 0 top
LED121  168,68.2 0 top
LED122  165.5,61.4 90 top
LED123  171.9,61.4 90 top
LED124  180.7,60.3 90 top
LED125  187.3,60.1 90 top
LED126  183.8,67.6 90 top
LED127  189.8,67.6 90 top
LED128  191.7,74.2 180 top
LED129  196.6,68.2 0 top
LED130  198.8,74.1 0 top
LED131  207,72.4 0 top
LED132  204.1,66 90 top
LED133  210.9,65.4 90 top
LED134  210.9,58.1 90 top
LED135  204.4,58 90 top
LED136  209.5,51.3 90 top
LED137  203,51.1 90 top
LED138  196.7,52.6 270 top
LED139  190.1,52.4 90 top
LED140  184.1,52.3 90 top
LED141  178.3,52.5 90 top
LED142  177,45.1 90 top
LED143  183.7,45 90 top
LED144  183.5,37.4 90 top
LED145  176.7,37.3 90 top
LED146  177.8,30.3 90 top
LED147  184.1,30.2 90 top
LED148  190.4,30.1 90 top
LED149  187.1,24 180 top
LED150  194.1,23.9 180 top
LED151  196.4,29.9 90 top
LED152  202.5,29 90 top
LED153  206.2,36.7 90 top
LED154  199.5,37.3 90 top

### Tracks (layer width: path | path; a pad name or v marks a point on that pad's centre or on a via)
5V  (via drill 0.35)
  Top 0.406: v16.9,85.1 17.93,85.1 LED1.1-VDD | v24.6,84.8 24.94,84.8 LED2.1-VDD | LED4.1-VDD 15.6,76.7 v15.4,76.7 | v22.6,76.6 22.6,76.7 LED3.1-VDD | v12.8,68.6 14.13,69.93 LED5.1-VDD | v21,68.2 22.21,69.41 LED6.1-VDD | LED9.1-VDD 11.73,62.03 v10.6,60.9 10.8,60.9 11.6,60.1 11.6,55.86 LED10.1-VDD | LED8.1-VDD 18.91,61.31 v18.1,60.5 18.73,60.5 LED11.1-VDD | v25.2,60.5 25.2,60.8 LED7.1-VDD | v31.5,60.8 31.5,61 LED28.1-VDD | LED27.1-VDD 35.25,59.65 v36.3,60.7 37.4,60.7 LED29.1-VDD | v22.8,52.5 22.96,52.5 LED12.1-VDD | v15.5,44.9 15.88,44.9 LED13.1-VDD | v8.1,44.8 9.51,46.21 LED14.1-VDD | LED16.1-VDD 15.91,37.11 v14.9,36.1 15.1,35.9 15.1,31.2 13.76,29.86 LED18.1-VDD | LED15.1-VDD 7.91,37.71 v6.1,35.9 5.3,35.1 4.7,35.1 4.1,34.5 4.1,30.7 5.77,29.03 LED17.1-VDD | v37.4,48.2 38.59,47.01 LED23.1-VDD | v31.9,33.4 32.52,34.02 LED22.1-VDD | v41.4,32.7 40.91,33.19 LED21.1-VDD | v32.1,25 32.1,26.47 LED19.1-VDD | v39.5,24.6 39.5,26.16 LED20.1-VDD | v44,48.1 44.29,48.1 LED24.1-VDD | v43.7,54.1 41.52,54.1 LED26.1-VDD | v52.3,54.6 49.47,54.6 LED25.1-VDD 49.24,57.86 46.65,60.45 LED30.1-VDD | v45.3,68.4 43.85,66.95 LED31.1-VDD | v53,68.6 51.85,67.45 LED32.1-VDD 49.45,68.65 LED33.1-VDD | v47,76.5 46.05,75.55 LED34.1-VDD | LED35.1-VDD 46.15,83.95 v45.1,85 44.15,85.95 LED38.1-VDD | v57,84.3 55.65,82.95 LED36.1-VDD | v58.5,92.8 56.95,91.25 LED37.1-VDD | LED39.1-VDD 73.2,78.2 73.2,78.8 73.7,79.3 76.2,79.3 LED40.1-VDD 80.2,75.3 v80.2,74.1 81.55,75.45 LED41.1-VDD | LED69.1-VDD 78.55,70.35 v79.7,71.5 80.6,71.5 80.65,71.44 82.46,71.44 LED42.1-VDD | v88.3,71.4 89,71.4 LED43.1-VDD | v93.2,64.4 92.05,63.25 LED44.1-VDD
  Top 0.406: v85.6,64.5 84.85,63.75 LED45.1-VDD | v92.7,56.7 91.15,55.15 LED47.1-VDD | v85.6,56.9 84.15,55.45 LED46.1-VDD | v91.7,49 90.25,47.55 LED49.1-VDD | v81,48.3 82.6,48.3 LED48.1-VDD | v89.3,40.8 88.45,39.95 LED50.1-VDD | v82.1,41.3 80.65,39.85 LED51.1-VDD | v81.8,25.6 81.75,25.65 LED52.1-VDD 81.35,28.45 LED53.1-VDD | LED55.1-VDD 73.8,29.8 v73.8,28.8 73.65,28.65 LED54.1-VDD | v66.5,29.9 65.75,29.15 LED56.1-VDD 63.85,29.15 LED58.1-VDD | v57,26.6 55.25,28.35 LED57.1-VDD | v59.2,42.2 59.1,42.2 LED59.1-VDD | v66.8,42.8 65.3,42.8 LED60.1-VDD | LED63.1-VDD 56.35,51.05 v57.1,50.3 LED61.1-VDD | LED62.1-VDD 65.6,50.9 v65.6,52.5 64.6,52.5 LED64.1-VDD | LED65.1-VDD 62.55,64.45 v63.7,63.3 67.4,63.3 LED66.1-VDD | LED68.1-VDD 66.65,71.95 LED67.1-VDD 63.9,73.6 JP2.1 | LED70.1-VDD 107.45,74.65 v109,76.2 112,76.2 LED71.1-VDD | v114.5,67.5 113.35,66.35 LED72.1-VDD | v106.7,67.9 105.65,66.85 LED73.1-VDD | v105.7,59.8 104.45,58.55 LED74.1-VDD | v113,59.3 112.05,58.35 LED75.1-VDD | v110.9,51.5 110.45,51.05 LED76.1-VDD | v103.4,51.9 102.25,50.75 LED77.1-VDD | v110.5,43.5 109.65,42.65 LED79.1-VDD | v101.4,43.9 100.35,42.85 LED78.1-VDD | v100.5,36.3 99.65,35.45 LED80.1-VDD | LED81.1-VDD 107.85,35.35 v108.6,36.1 112.15,32.55 LED83.1-VDD | v98.5,27.1 99.45,28.05 LED82.1-VDD | LED84.1-VDD 118.15,35.95 118.6,36.4 123.5,36.4 v123.6,36.5 124.05,36.05 LED87.1-VDD | v131.6,35.7 130.65,34.75 LED88.1-VDD | v115.3,26.9 116.5,26.9 LED85.1-VDD | v123.6,26.1 124.75,27.25 LED86.1-VDD | LED89.1-VDD 127.3,43.9 v125.8,43.9 125.36,43.46 124.95,43.46 124.15,42.65 LED90.1-VDD | LED91.1-VDD 124.35,50.25 v125.9,51.8 129.8,51.8 LED92.1-VDD
  Top 0.406: LED94.1-VDD 126.45,58.25 v128,59.8 131.6,59.8 132.35,59.05 LED93.1-VDD | LED95.1-VDD 128.6,67.3 v129.1,67.3 132.7,67.3 LED96.1-VDD | LED97.1-VDD 129.15,73.55 v130.9,75.3 133.8,75.3 LED98.1-VDD | LED99.1-VDD 141.1,41.6 v141.1,42 145.2,42 146.35,40.85 LED100.1-VDD | v141.6,34.2 LED101.1-VDD | LED102.1-VDD 151.2,34.6 v152.2,34.6 155.6,34.6 156.65,33.55 LED105.1-VDD | v145,24.8 145.3,24.8 LED103.1-VDD | v152.8,24.2 154.55,25.95 LED104.1-VDD | v162.4,33.9 163,33.9 LED106.1-VDD | LED108.1-VDD 162.45,40.25 v161.4,41.3 | LED107.1-VDD 168.45,40.05 v167.2,41.3 | v157.9,48.9 156.95,47.95 LED111.1-VDD | LED110.1-VDD 162.45,47.75 v164.4,49.7 166.5,49.7 LED109.1-VDD | v159.4,57.1 159.4,56 LED113.1-VDD | LED112.1-VDD 150.6,56.2 v150.6,57 149.35,58.25 LED114.1-VDD | v142.7,57.3 142.7,59 LED115.1-VDD | LED116.1-VDD 149.7,74.1 v150.2,74.1 | LED117.1-VDD 150.2,73.9 v150.2,74.1 | v150.2,74.1 152.2,74.1 LED118.1-VDD | LED119.1-VDD 156.05,69.65 154.6,68.2 154.6,64.9 156.8,62.7 JP4.1 | v169,72.5 168.75,72.25 LED120.1-VDD | LED122.1-VDD 168.15,63.85 v168.9,64.6 168.9,65 LED121.1-VDD 170.85,66.55 LED123.1-VDD | LED124.1-VDD 183.25,62.75 v184.5,64 187.2,64 188.65,62.55 LED125.1-VDD | LED126.1-VDD 185.5,70.1 v185.5,71.7 189.25,75.45 LED128.1-VDD | v193.1,70.8 192.35,70.05 LED127.1-VDD | v201.5,69.9 199.05,67.45 LED129.1-VDD | LED130.1-VDD 201.5,72.2 v201.5,69.9 | LED131.1-VDD 210.1,70.1 v212.2,70.1 212.55,69.75 LED133.1-VDD | LED132.1-VDD 205.55,68.45 204.1,69.9 v201.5,69.9 | LED134.1-VDD 214.1,59 214.3,59 214.3,54.4 v213.8,53.9 213.65,53.75 LED136.1-VDD | v207.7,61.8 206.35,60.45 LED135.1-VDD
  Top 0.406: LED137.1-VDD 204.3,53.9 204.3,56.7 203.3,57.7 201,57.7 200.3,57 v200.3,56 | LED138.1-VDD 195.05,51.15 v193.5,52.7 191.75,54.45 LED139.1-VDD | LED140.1-VDD 185.75,55.65 v185,56.4 184.9,56.3 181.1,56.3 179.95,55.15 LED141.1-VDD | LED142.1-VDD 179.55,47.55 v180.8,48.8 181.8,48.8 181.85,48.74 184.06,48.74 LED143.1-VDD | LED144.1-VDD 185.15,41.05 185,41.2 v179.9,41.2 178.45,39.75 LED145.1-VDD | LED146.1-VDD 180.85,32.75 181.85,33.76 184.64,33.76 LED147.1-VDD 187.15,32.65 188.15,33.66 190.26,33.66 v190.5,33.9 191.85,32.55 LED148.1-VDD | LED151.1-VDD 198.7,33 v200.6,33 202.6,33 LED152.1-VDD | LED150.1-VDD 191.65,25.75 v190.6,26.8 190.3,26.5 185.5,26.5 LED149.1-VDD | LED153.1-VDD 206.25,39.15 205.15,40.26 204.04,40.26 v203.1,41.2 201.65,39.75 LED154.1-VDD
  other vias: 55.7,76.5
  pour Bottom: 0,108 0,0 218,0 218,108
GND  (via drill 0.35)
  Top 0.406: LED148.3-GND v187.3,27.7 | LED142.3-GND 176.65,42.65 176.7,42.6 177,42.6 v177.1,42.7 | v180.4,42.6 182,42.6 LED143.3-GND | v185.1,37.2 184.1,37.2 LED144.3-GND | LED87.3-GND 122.25,29.85 122.3,29.8 v122.6,29.8 | v125.1,29.5 126,29.5 LED88.3-GND
  Bottom 0.406: v187.3,27.7 185.04,27.7 184.4,28.33 184,28.33 v183.9,28.51 185.29,29.9 185.3,29.9 185.3,37.1 185.2,37.2 v185.1,37.2 | v177.1,42.7 180.3,42.7 v180.4,42.6 | v122.6,29.8 124.8,29.8 v125.1,29.5
  pour Top: 0.1,108 0,-0.1 218,0 218,108
N$1
  Top 0.406: LED5.2-DOUT 18.61,71.22 LED6.4-DIN
N$2
  Top 0.406: LED2.4-DIN 25.96,89.83 LED1.2-DOUT
N$3
  Top 0.406: LED2.2-DOUT 27.74,84.3 25.3,84.3 LED3.4-DIN
N$4
  Top 0.406: LED4.4-DIN 19.5,80.4 24.9,80.4 LED3.2-DOUT
N$5
  Top 0.406: LED4.2-DOUT 18.6,76.4 16.88,76.4 LED5.4-DIN
N$6
  Top 0.406: LED6.2-DOUT 26.21,69.22 LED7.4-DIN
N$7
  Top 0.406: LED7.2-DOUT 27.12,64.2 21.4,64.2 LED8.4-DIN
N$8
  Top 0.406: LED8.2-DOUT 19.81,64.2 14.89,64.2 LED9.4-DIN
N$9
  Top 0.406: LED9.2-DOUT 13.79,63.7 10.8,63.7 9.5,62.4 9.5,59.98 LED10.4-DIN
N$10
  Top 0.406: LED10.2-DOUT 15.04,56 18.33,56 LED11.4-DIN
N$11
  Top 0.406: LED11.2-DOUT 17.71,58.69 19.7,56.7 22.26,56.7 LED12.4-DIN
N$12
  Top 0.406: LED12.2-DOUT 23.26,49.5 19.4,49.5 19.2,49.3 17.31,51.19 LED13.4-DIN
N$13
  Top 0.406: LED14.4-DIN 11.93,49.2 17.74,49.2 LED13.2-DOUT
N$14
  Top 0.406: LED14.2-DOUT 9.2,43.11 LED15.4-DIN
N$15
  Top 0.406: LED15.2-DOUT 11.21,38.5 LED16.4-DIN
N$16
  Top 0.406: LED16.2-DOUT 19,38.3 16.9,40.4 15.9,40.4 11.3,35.8 7.73,35.8 LED17.4-DIN
N$17
  Top 0.406: LED17.2-DOUT 13.76,33.63 LED18.4-DIN
N$18
  Top 0.406: LED18.2-DOUT 19.65,31.81 LED19.4-DIN
N$19
  Top 0.406: LED19.2-DOUT 39.16,31.11 LED20.4-DIN
N$20
  Top 0.406: LED20.2-DOUT 42.46,29.26 43.5,30.3 43.5,33 41.72,34.78 41.72,35.13 40.91,35.93 LED21.4-DIN
N$21  (via drill 0.35)
  Top 0.406: LED21.2-DOUT 42.8,35.64 42.8,36 42.3,36.5 v42.2,36.5 | v35.6,36.3 33.91,37.99 LED22.4-DIN
  Bottom 0.406: v42.2,36.5 42,36.3 v35.6,36.3
N$22
  Top 0.406: LED22.2-DOUT 37.21,35.61 38.8,37.2 38.8,41.78 LED23.4-DIN
N$23
  Top 0.406: LED24.4-DIN 43.59,43.9 37.6,43.9 35.29,46.21 LED23.2-DOUT
N$24
  Top 0.406: LED24.2-DOUT 44.99,44.1 46.6,44.1 49.24,46.74 LED25.4-DIN
N$25
  Top 0.406: LED26.4-DIN 41.35,49.78 LED25.2-DOUT
N$26
  Top 0.406: LED26.2-DOUT 37.51,54.55 LED27.4-DIN
N$27
  Top 0.406: LED27.2-DOUT 34.4,61.9 34.4,65.3 LED28.4-DIN
N$28
  Top 0.406: LED28.2-DOUT 38.05,62.15 39.25,60.94 39.46,60.94 40.45,59.95 LED29.4-DIN
N$29  (via drill 0.35)
  Top 0.406: LED30.4-DIN 50.4,59.7 v49.4,59.7 | v40.2,57.7 39.15,56.65 LED29.2-DOUT
  Bottom 0.406: v49.4,59.7 47.5,57.8 40.3,57.8 v40.2,57.7
N$30
  Top 0.406: LED31.4-DIN 43.35,62.05 45,60.4 45,58 45.85,57.15 LED30.2-DOUT
N$31
  Top 0.406: LED31.2-DOUT 42,64.8 42,64.6 42.1,64.5 49.4,64.5 50.65,63.25 LED32.4-DIN
N$32
  Top 0.406: LED32.2-DOUT 47.35,71.95 47.2,72.1 47.2,73.6 LED33.4-DIN
N$33  (via drill 0.35)
  Top 0.406: LED34.4-DIN 44.85,71.25 v45.6,72 | v51.6,72.1 LED33.2-DOUT
  Bottom 0.406: v45.6,72 51.3,72 51.4,72.1 v51.6,72.1
N$34
  Top 0.406: LED34.2-DOUT LED35.4-DIN
N$35
  Top 0.406: LED35.2-DOUT 46.8,80.6 52.1,80.6 LED36.4-DIN
N$36
  Top 0.406: LED36.2-DOUT 52.2,84.6 54.9,84.6 56.15,85.85 LED37.4-DIN
N$37
  Top 0.406: LED37.2-DOUT 50.8,89.2 45.9,89.2 44.15,90.95 LED38.4-DIN
N$38
  Top 0.406: LED38.2-DOUT 50.35,86.85 51.5,88 58.5,88 67.3,79.2 67.3,74.9 68.3,73.9 70.3,73.9 LED39.4-DIN
N$39
  Top 0.406: LED40.2-DOUT 78.8,73.4 79.7,73.4 80.1,73 80.5,73 81.3,73.8 85.1,73.8 86.45,75.15 LED41.4-DIN
N$40  (via drill 0.35)
  Top 0.406: LED42.2-DOUT 83.5,67.1 83.6,67.1 83.7,67 v83.7,66.9 | v87.8,66.8 89.25,65.35 LED43.4-DIN
  Bottom 0.406: v83.7,66.9 87.5,66.9 87.6,66.8 v87.8,66.8
N$41
  Top 0.406: LED43.2-DOUT 89.7,67.4 92.6,67.4 94.7,65.3 94.7,61.3 LED44.4-DIN
N$42
  Top 0.406: LED44.2-DOUT 84.85,59.65 LED45.4-DIN
N$43
  Top 0.406: LED45.2-DOUT 81.55,61.35 83.1,59.8 83.1,51.4 LED46.4-DIN
N$44
  Top 0.406: LED46.2-DOUT 80.85,54.55 82.3,53.1 82.3,50.4 83.6,49.1 89.7,49.1 LED47.4-DIN
N$45  (via drill 0.35)
  Top 0.406: LED47.2-DOUT 87.55,52.45 85.8,50.7 v85.8,50.4 | v84.2,45 82.65,43.45 LED48.4-DIN
  Bottom 0.406: v85.8,50.4 85.8,46.5 84.3,45 v84.2,45
N$46
  Top 0.406: LED48.2-DOUT 81.7,45.9 86.5,45.9 LED49.4-DIN
N$47
  Top 0.406: LED49.2-DOUT 89.4,44.6 90.7,44.6 91.5,43.8 91.5,39.2 LED50.4-DIN
N$48
  Top 0.406: LED50.2-DOUT 80.35,36.25 LED51.4-DIN
N$49
  Top 0.406: LED51.2-DOUT 77.05,37.95 78.9,36.1 78.9,33.4 79.35,32.95 LED52.4-DIN
N$50
  Top 0.406: LED52.2-DOUT 83.4,26.4 83.4,24.9 82.05,23.55 LED53.4-DIN
N$51
  Top 0.406: LED53.2-DOUT 71.75,24.75 LED54.4-DIN
N$52
  Top 0.406: LED54.2-DOUT 68.45,29.35 LED55.4-DIN
N$53
  Top 0.406: LED55.2-DOUT 72.5,31.8 68.9,31.8 67.6,30.5 67.6,27.7 LED56.4-DIN
N$54
  Top 0.406: LED57.4-DIN 55.25,32.45 55.9,31.8 58.2,31.8 LED56.2-DOUT
N$55  (via drill 0.35)
  Top 0.406: LED57.2-DOUT 57.5,30 57.3,30 v56.7,30.6 | v61.4,34.2 61.4,36.4 LED58.4-DIN
  Bottom 0.406: v56.7,30.6 60.4,34.3 61.3,34.3 v61.4,34.2
N$56
  Top 0.406: LED58.2-DOUT 64.25,31.55 62.8,33 60.5,33 59.8,33.7 59.8,35 58.85,35.95 LED59.4-DIN
N$57
  Top 0.406: LED59.2-DOUT 56.5,38.8 59.1,38.8 60.6,40.3 63,40.3 64.55,38.75 LED60.4-DIN
N$58
  Top 0.406: LED60.2-DOUT 58.95,43.55 LED61.4-DIN
N$59
  Top 0.406: LED61.2-DOUT 56.5,47.6 63.9,47.6 LED62.4-DIN
N$60
  Top 0.406: LED62.2-DOUT 61.7,50.3 59,50.3 58,51.3 58,53.9 56.35,55.55 LED63.4-DIN
N$61
  Top 0.406: LED63.2-DOUT 59.65,53.55 LED64.4-DIN
N$62
  Top 0.406: LED64.2-DOUT 67.35,56.05 65,58.4 65,59 64.6,59.4 61.7,59.4 LED65.4-DIN
N$63
  Top 0.406: LED41.2-DOUT 83.45,72.25 85,70.7 85,66.5 LED42.4-DIN
N$64
  Top 0.406: LED65.2-DOUT 61,61.7 67.4,61.7 LED66.4-DIN
N$65
  Top 0.406: LED66.2-DOUT 65.55,65.15 LED67.4-DIN
N$66
  Top 0.406: LED67.2-DOUT 65.4,68.8 72,68.8 LED68.4-DIN
N$67
  Top 0.406: LED68.2-DOUT 68.9,66.4 71.4,66.4 74.2,63.6 76.9,63.6 78.55,65.25 LED69.4-DIN
N$68  (via drill 0.35)
  Top 0.406: LED69.2-DOUT 77.2,68.3 77.7,68.3 v77.8,68.4 | v105.1,70.8 105.8,70.8 LED70.4-DIN
  Bottom 0.406: v77.8,68.4 102.6,68.4 105,70.8 v105.1,70.8
N$69
  Top 0.406: LED70.2-DOUT 105.6,72.6 105.6,72.5 106,72.1 111.9,72.1 113.65,70.35 LED71.4-DIN
N$70
  Top 0.406: LED71.2-DOUT 113,71.9 114.5,71.9 115.5,70.9 115.5,64.4 LED72.4-DIN
N$71
  Top 0.406: LED72.2-DOUT 109.25,65.65 LED73.4-DIN
N$72
  Top 0.406: LED73.2-DOUT 102.25,65.55 103.2,64.6 103.2,59.9 102.9,59.6 102.9,54.7 LED74.4-DIN
N$73  (via drill 0.35)
  Top 0.406: LED74.2-DOUT 101.5,56.6 v101.5,56.5 | v107.3,55.6 LED75.4-DIN
  Bottom 0.406: v101.5,56.5 107.3,55.7 v107.3,55.6
N$74
  Top 0.406: LED75.2-DOUT 110.5,55.2 111.5,55.2 113,53.7 113,49.5 109.65,46.15 LED76.4-DIN
N$75
  Top 0.406: LED77.4-DIN 105.35,49.25 LED76.2-DOUT
N$76
  Top 0.406: LED77.2-DOUT 97.1,49.2 97.1,45 98.4,43.7 98.4,39.6 LED78.4-DIN
N$77
  Top 0.406: LED39.2-DOUT 70.8,75 75.6,75 LED40.4-DIN
N$78
  Top 0.406: LED79.2-DOUT 103.75,42.25 101.6,40.1 101.6,32.8 LED80.4-DIN
N$79
  Top 0.406: LED81.2-DOUT 105.55,33.15 LED82.4-DIN
N$80
  Top 0.406: LED83.4-DIN 112.35,27.35 110.8,25.8 104,25.8 103.7,26.1 102,26.1 LED82.2-DOUT
N$81
  Top 0.406: LED83.2-DOUT 112.8,28.8 116.9,28.8 LED84.4-DIN
N$82
  Top 0.406: LED84.2-DOUT 117.8,32 119,32 119.6,31.4 119.6,28.4 120.15,27.85 LED85.4-DIN
N$83
  Top 0.406: LED85.2-DOUT 120.15,24.55 121.4,23.3 126.1,23.3 129.65,26.85 LED86.4-DIN
N$84
  Top 0.406: LED86.2-DOUT 124.75,26.15 127.7,29.1 127.7,30.7 127.1,31.3 125.5,31.3 LED87.4-DIN
N$85
  Top 0.406: LED87.2-DOUT 122.7,32.8 126.7,32.8 LED88.4-DIN
N$86
  Top 0.406: LED89.4-DIN 128.85,37.25 LED88.2-DOUT
N$87
  Top 0.406: LED89.2-DOUT 122.15,38.95 LED90.4-DIN
N$88
  Top 0.406: LED90.2-DOUT 120.2,44 122.6,44 LED91.4-DIN
N$89
  Top 0.406: LED91.2-DOUT 122.7,48.2 122.7,47.4 123.2,46.9 129.8,46.9 LED92.4-DIN
N$90
  Top 0.406: LED92.2-DOUT 129.7,48.6 132.1,48.6 132.9,49.4 132.9,53.1 LED93.4-DIN
N$91
  Top 0.406: LED94.4-DIN 129.05,56.15 LED93.2-DOUT
N$92
  Top 0.406: LED94.2-DOUT 124.45,58.25 LED95.4-DIN
N$93
  Top 0.406: LED95.2-DOUT 126.3,63.6 132.5,63.6 133.85,62.25 LED96.4-DIN
N$94
  Top 0.406: LED96.2-DOUT 128.7,64.3 127,64.3 125.8,65.5 125.8,66.5 127.95,68.65 LED97.4-DIN
N$95
  Top 0.406: LED97.2-DOUT 127.3,71.4 132.9,71.4 135.55,68.75 LED98.4-DIN
N$96
  Top 0.406: LED98.2-DOUT 133.25,73.55 138.7,68.1 138.7,36.4 LED99.4-DIN
N$97  (via drill 0.35)
  Top 0.406: LED99.2-DOUT 137.4,39.3 137.4,38.3 v137.3,38.3 | v146.4,38 146.4,35.6 LED100.4-DIN
  Bottom 0.406: v137.3,38.3 146.2,38.3 146.4,38.1 v146.4,38
N$98
  Top 0.406: LED100.2-DOUT 143.05,38.25 144.4,36.9 144.4,29.4 LED101.4-DIN
N$99
  Top 0.406: LED101.2-DOUT 141.4,31.1 141.4,27.2 142.1,26.5 144.3,26.5 144.9,27.1 148.6,27.1 LED102.4-DIN
N$100
  Top 0.406: LED102.2-DOUT 149.7,30.1 150.6,30.1 151.55,29.15 LED103.4-DIN
N$101
  Top 0.406: LED103.2-DOUT 147.55,22.85 149.3,21.1 160.6,21.1 161,21.5 161,24.5 LED104.4-DIN
N$102  (via drill 0.35)
  Top 0.406: LED80.2-DOUT 97.8,33.7 97.8,33 v97.9,33 | v106.4,32.9 106.65,32.65 LED81.4-DIN
  Bottom 0.406: v97.9,33 106.3,33 v106.4,32.9
N$103
  Top 0.406: LED104.2-DOUT 154.55,23.05 156.9,25.4 156.9,27.9 LED105.4-DIN
N$104
  Top 0.406: LED105.2-DOUT 155.5,30.9 162,30.9 163.95,28.95 LED106.4-DIN
N$105
  Top 0.406: LED106.2-DOUT 161.45,32.95 163.1,31.3 167.5,31.3 169.15,32.95 LED107.4-DIN
N$106
  Top 0.406: LED108.4-DIN 162.85,37.05 LED107.2-DOUT
N$107
  Top 0.406: LED108.2-DOUT 161.2,38.6 163.1,38.6 164.6,40.1 164.6,41 164.1,41.5 164.1,43.7 164.7,44.3 167,44.3 LED109.4-DIN
N$108
  Top 0.406: LED110.4-DIN 162.45,44.65 LED109.2-DOUT
N$109
  Top 0.406: LED111.4-DIN 156.55,44.95 LED110.2-DOUT
N$110
  Top 0.406: LED111.2-DOUT 151.45,49.75 LED112.4-DIN
N$111
  Top 0.406: LED112.2-DOUT 150.4,53.1 156.3,53.1 LED113.4-DIN
N$112
  Top 0.406: LED113.2-DOUT 155.55,59.25 152.4,62.4 150.1,62.4 149.35,63.15 LED114.4-DIN
N$113
  Top 0.406: LED114.2-DOUT 150.4,61 144.4,61 142.65,62.75 LED115.4-DIN
N$114
  Top 0.406: LED115.2-DOUT 145.1,59.9 144,59.9 141.4,62.5 141.4,66.7 142.6,67.9 144.9,67.9 LED116.4-DIN
N$115
  Top 0.406: LED116.2-DOUT 145.9,68.5 151.1,68.5 153.05,66.55 LED117.4-DIN
N$116  (via drill 0.35)
  Top 0.406: LED78.2-DOUT 96.75,40.95 v97.2,40.5 | v105.6,39.8 107.05,38.35 LED79.4-DIN
  Bottom 0.406: v97.2,40.5 97.8,39.9 105.5,39.9 v105.6,39.8
N$117  (via drill 0.35)
  Top 0.406: LED118.2-DOUT 155.5,74.1 v155.7,74.1 | v159.37,69.03 160.39,70.05 LED119.4-DIN
  Bottom 0.406: v155.7,74.1 158.7,71.1 158.7,69.7 v159.37,69.03
N$118
  Top 0.406: LED121.4-DIN 163.6,68.5 163.6,72.5 LED120.2-DOUT
N$119  (via drill 0.35)
  Top 0.406: LED121.2-DOUT 167.6,67 167.6,65.8 166.9,65.1 165.9,65.1 165.6,64.8 165.6,63 v165.8,62.8 | v166,59.6 166.65,58.95 LED122.4-DIN
  Bottom 0.406: v165.8,62.8 165.8,60 166,59.8 v166,59.6
N$120
  Top 0.406: LED123.4-DIN 171.2,61.3 165.4,61.3 163.85,62.85 LED122.2-DOUT
N$121
  Top 0.406: LED123.2-DOUT 172.3,61.8 177.5,61.8 181.45,57.85 LED124.4-DIN
N$122
  Top 0.406: LED124.2-DOUT 181.2,60.6 181.2,60.5 181.6,60.1 186.5,60.1 LED125.4-DIN
N$123  (via drill 0.35)
  Top 0.406: LED125.2-DOUT 186.4,61.8 186.8,61.8 186.9,61.9 v186.9,62.4 | v185.2,67 185.45,66.75 LED126.4-DIN
  Bottom 0.406: v186.9,62.4 185.23,64.07 185.23,64.3 185.1,64.44 185.1,67 v185.2,67
N$124
  Top 0.406: LED126.2-DOUT 183.9,68.3 188.3,68.3 LED127.4-DIN
N$125
  Top 0.406: LED127.2-DOUT 189.6,71.5 190.8,71.5 192,72.7 192,73.8 194.05,75.85 LED128.4-DIN
N$126
  Top 0.406: LED128.2-DOUT 187.9,71.2 187.1,71.2 186.9,71 186.9,69.2 187.24,68.86 191.84,68.86 LED129.4-DIN
N$127
  Top 0.406: LED129.2-DOUT 196.45,72.45 LED130.4-DIN
N$128
  Top 0.406: LED130.2-DOUT 203.2,73.8 203.2,72.1 LED131.4-DIN
N$129
  Top 0.406: LED131.2-DOUT 209.45,73.75 207.1,71.4 207.1,64.9 LED132.4-DIN
N$130  (via drill 0.35)
  Top 0.406: LED132.2-DOUT 205.1,65.8 205.3,65.8 v205.4,65.7 | v210.6,65.5 212.55,63.55 LED133.4-DIN
  Bottom 0.406: v205.4,65.7 210.2,65.7 210.4,65.5 v210.6,65.5
N$131
  Top 0.406: LED133.2-DOUT 209.25,65.25 211.5,63 211.5,56.3 212.15,55.65 LED134.4-DIN
N$132
  Top 0.406: LED135.4-DIN 206.05,57.35 LED134.2-DOUT
N$133  (via drill 0.35)
  Top 0.406: LED135.2-DOUT 204.6,58.6 v204.6,57.5 | v212.7,48.8 211.2,48.8 LED136.4-DIN
  Bottom 0.406: v204.6,57.5 212.7,49.4 v212.7,48.8
N$134
  Top 0.406: LED136.2-DOUT 207.85,51.85 LED137.4-DIN
N$135
  Top 0.406: LED137.2-DOUT 200.6,52.8 197.3,52.8 LED138.4-DIN
N$136
  Top 0.406: LED138.2-DOUT 196.6,48.4 193.3,48.4 LED139.4-DIN
N$137
  Top 0.406: LED139.2-DOUT 185.75,52.15 LED140.4-DIN
N$138
  Top 0.406: LED140.2-DOUT 182.45,52.55 LED141.4-DIN
N$139
  Top 0.406: LED141.2-DOUT 176.65,52.95 173.8,50.1 173.8,45.8 174.9,44.7 177.4,44.7 178.65,43.45 LED142.4-DIN
N$140
  Top 0.406: LED142.2-DOUT 175.45,47.55 178.2,44.8 183.4,44.8 185.35,42.85 LED143.4-DIN
N$141
  Top 0.406: LED119.2-DOUT 159,69.7 159,70.7 160.55,72.25 LED120.4-DIN
N$142
  Top 0.406: LED143.2-DOUT 185.3,44.2 186.4,44.2 187.5,43.1 187.5,37.3 LED144.4-DIN
N$143
  Top 0.406: LED145.4-DIN 181.85,38.35 LED144.2-DOUT
N$144
  Top 0.406: LED145.2-DOUT 177.3,37.5 177.3,30 LED146.4-DIN
N$145  (via drill 0.35)
  Top 0.406: LED146.2-DOUT 175.9,32.5 175.9,31 v175.8,30.9 | v183.6,30 185.75,27.85 LED147.4-DIN
  Bottom 0.406: v175.8,30.9 182.7,30.9 v183.6,30
N$146
  Top 0.406: LED147.2-DOUT 184.6,30.5 189.2,30.5 LED148.4-DIN
N$147  (via drill 0.35)
  Top 0.406: LED148.2-DOUT 190.3,31 190.5,31 190.6,30.9 v190.6,30.8 | v187.3,24.3 188.65,25.65 LED149.4-DIN
  Bottom 0.406: v190.6,30.8 190.6,27.84 189.87,27.1 189.87,26.97 187.3,24.4 v187.3,24.3
N$148
  Top 0.406: LED149.2-DOUT 187.05,22.35 189.1,24.4 195.4,24.4 LED150.4-DIN
N$149
  Top 0.406: LED150.2-DOUT 192.95,22.25 194.5,23.8 197.8,23.8 198.05,24.05 LED151.4-DIN
N$150
  Top 0.406: LED151.2-DOUT 196.9,30.2 196.9,30.1 197.7,29.3 201.9,29.3 204.15,27.05 LED152.4-DIN
N$151
  Top 0.406: LED152.2-DOUT 202.3,30 205.9,30 207.85,31.95 LED153.4-DIN
N$152
  Top 0.406: LED153.2-DOUT 204.55,38.25 LED154.4-DIN
N$153  (via drill 0.35)
  other vias: 184.1,27.6
N$154  (via drill 0.35)
  other vias: 185.9,29.3
N$155
  Top 0.406: LED117.2-DOUT 152,68.8 152.8,68.8 159.15,75.15 LED118.4-DIN
N$159
  Top 0.406: LED154.2-DOUT 197.85,41.95 200.8,44.9 214.6,44.9 JP7.1
SIGNALIN
  Top 0.406: JP6.1 4.99,104.6 LED1.4-DIN
(copper drawn outside any net)
  shapes: Top area x2

### Text on the board
tNames: 5V | 5V | 5V | GND | 5V | 5V